# EasyEDA Pro project ProPrj_温室控制单_2026-01-03.epro

# Schematic Schematic1

## Sheets
1 主: Board Name: Board1; Create Date: 2025-12-29; Page Name: 主; Project Name: 温室控制单; Schematic Name: Schematic1; Update Date: 2025-12-29; Company: 嘉立创EDA; Page Size: A4; Version: V1.0
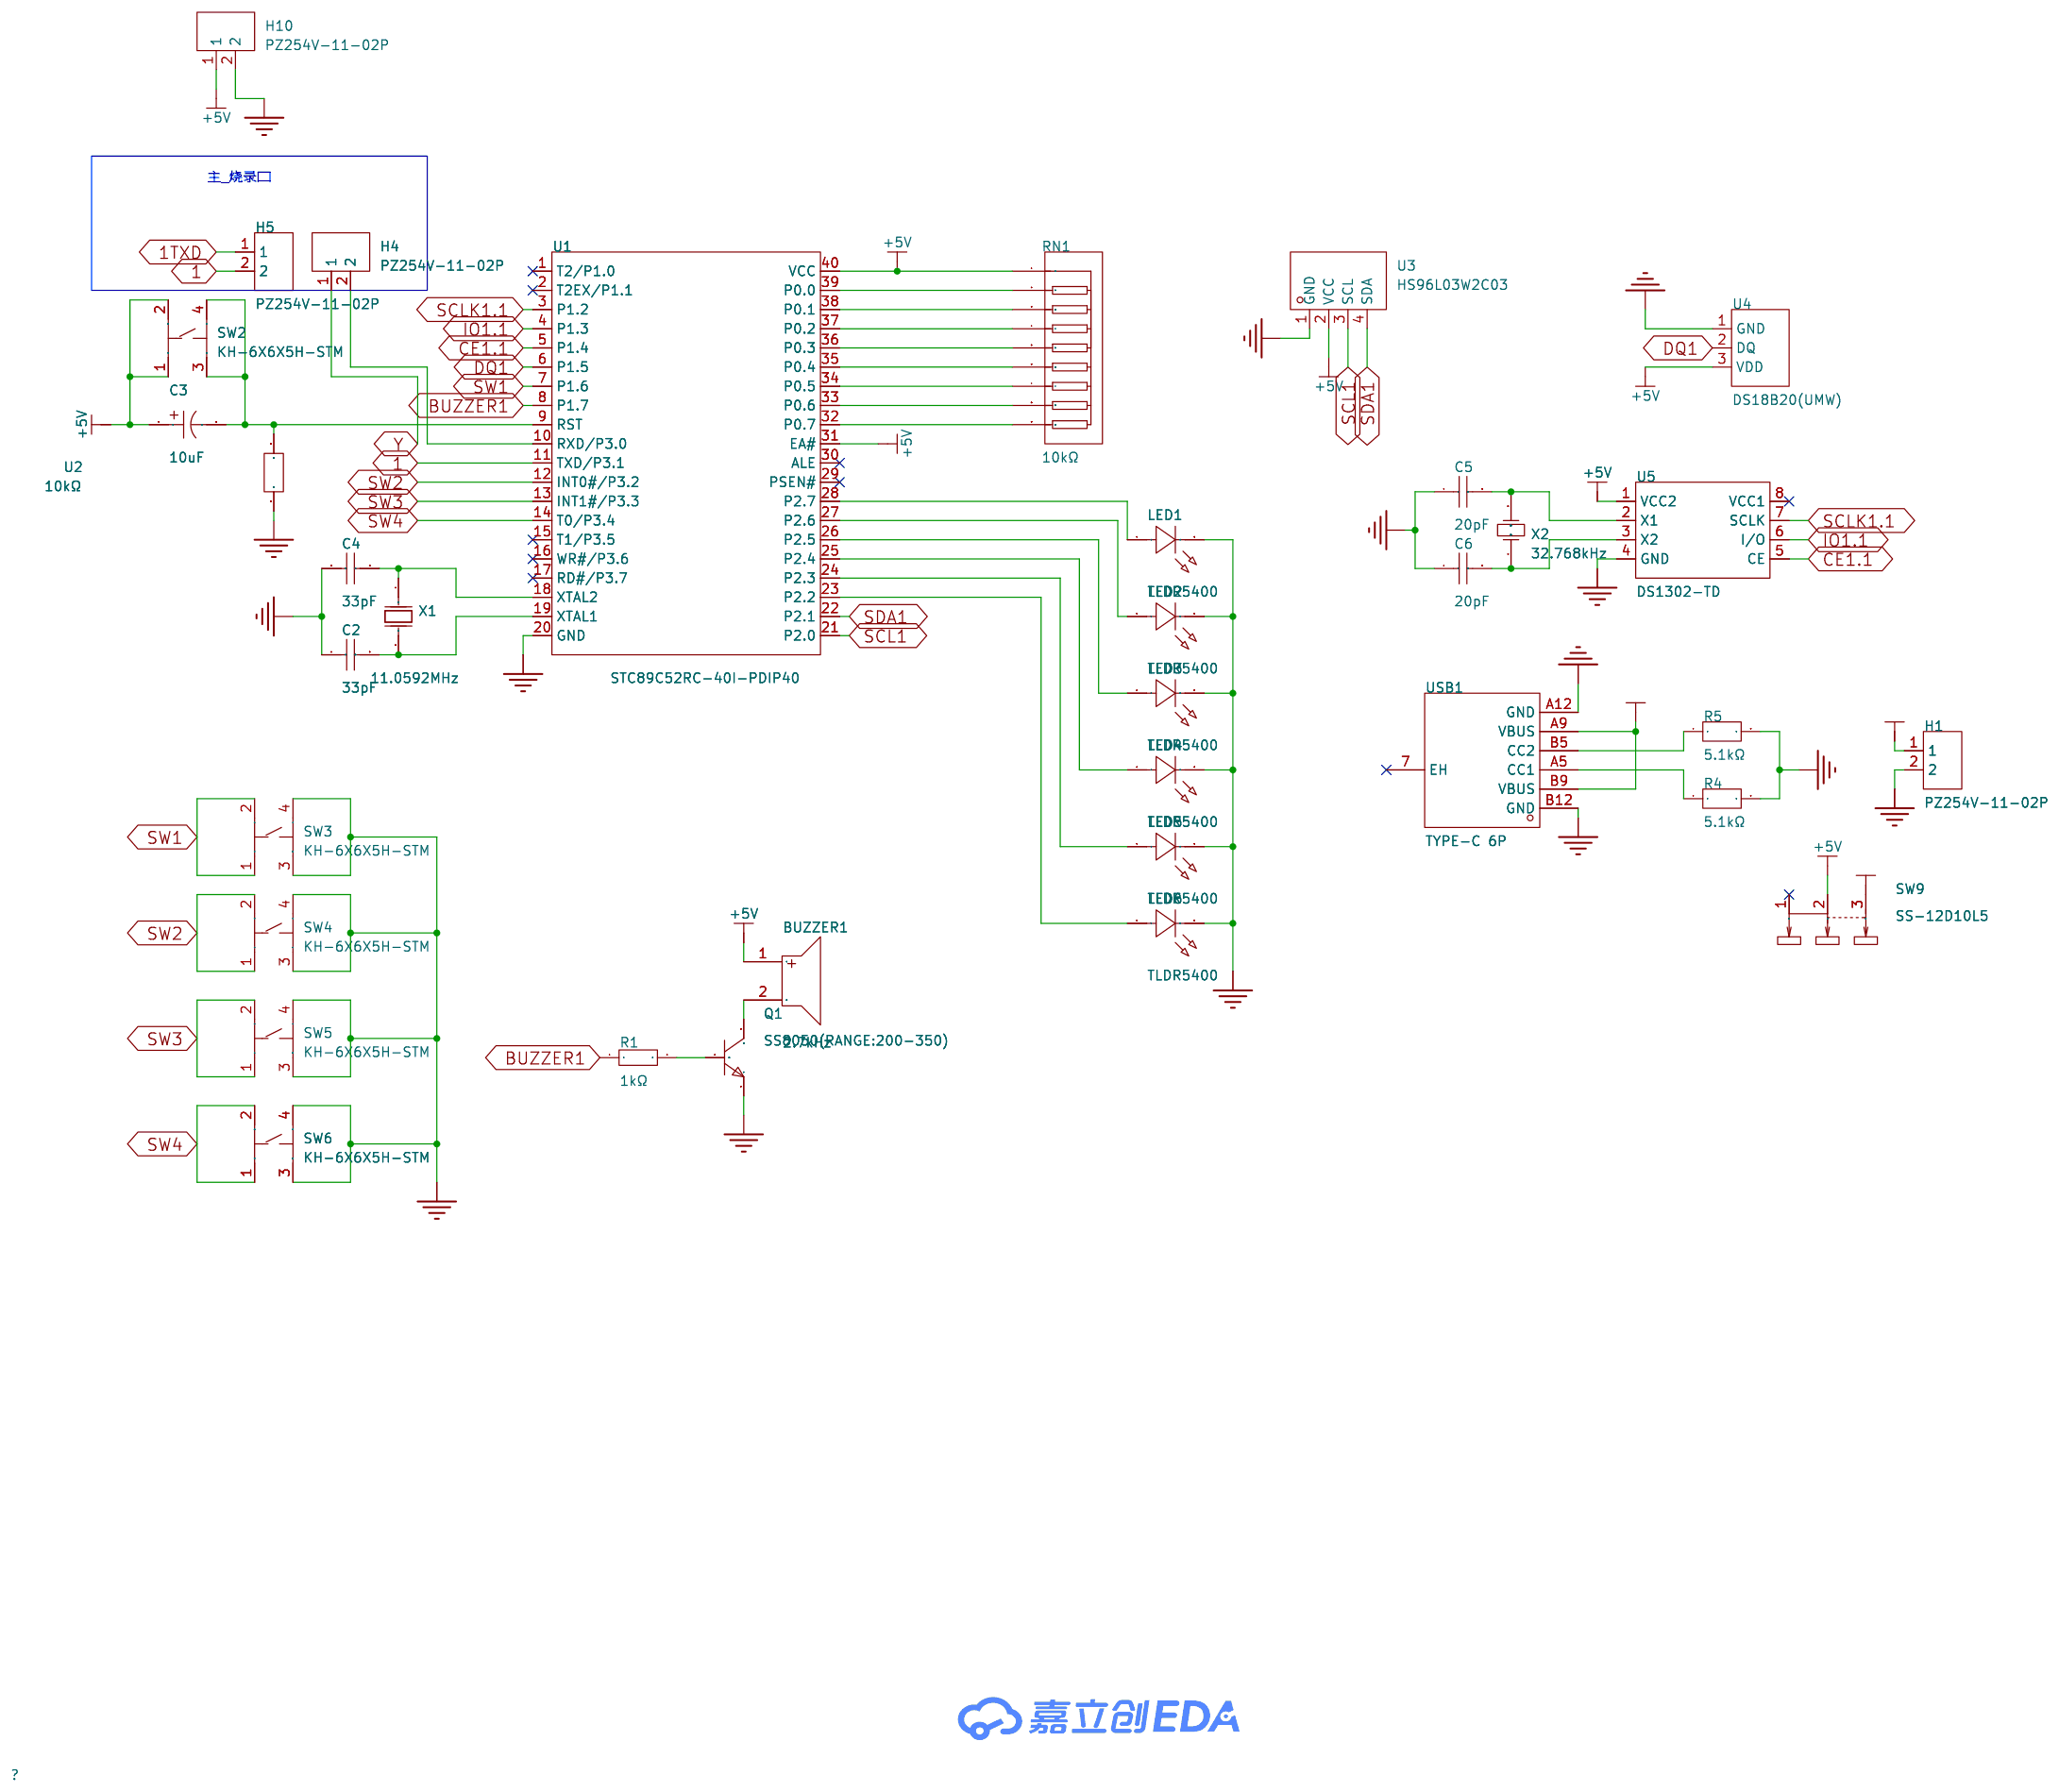
[diagram p0: 主]
2 从1: Page Name: 从1; Update Date: 2026-01-03
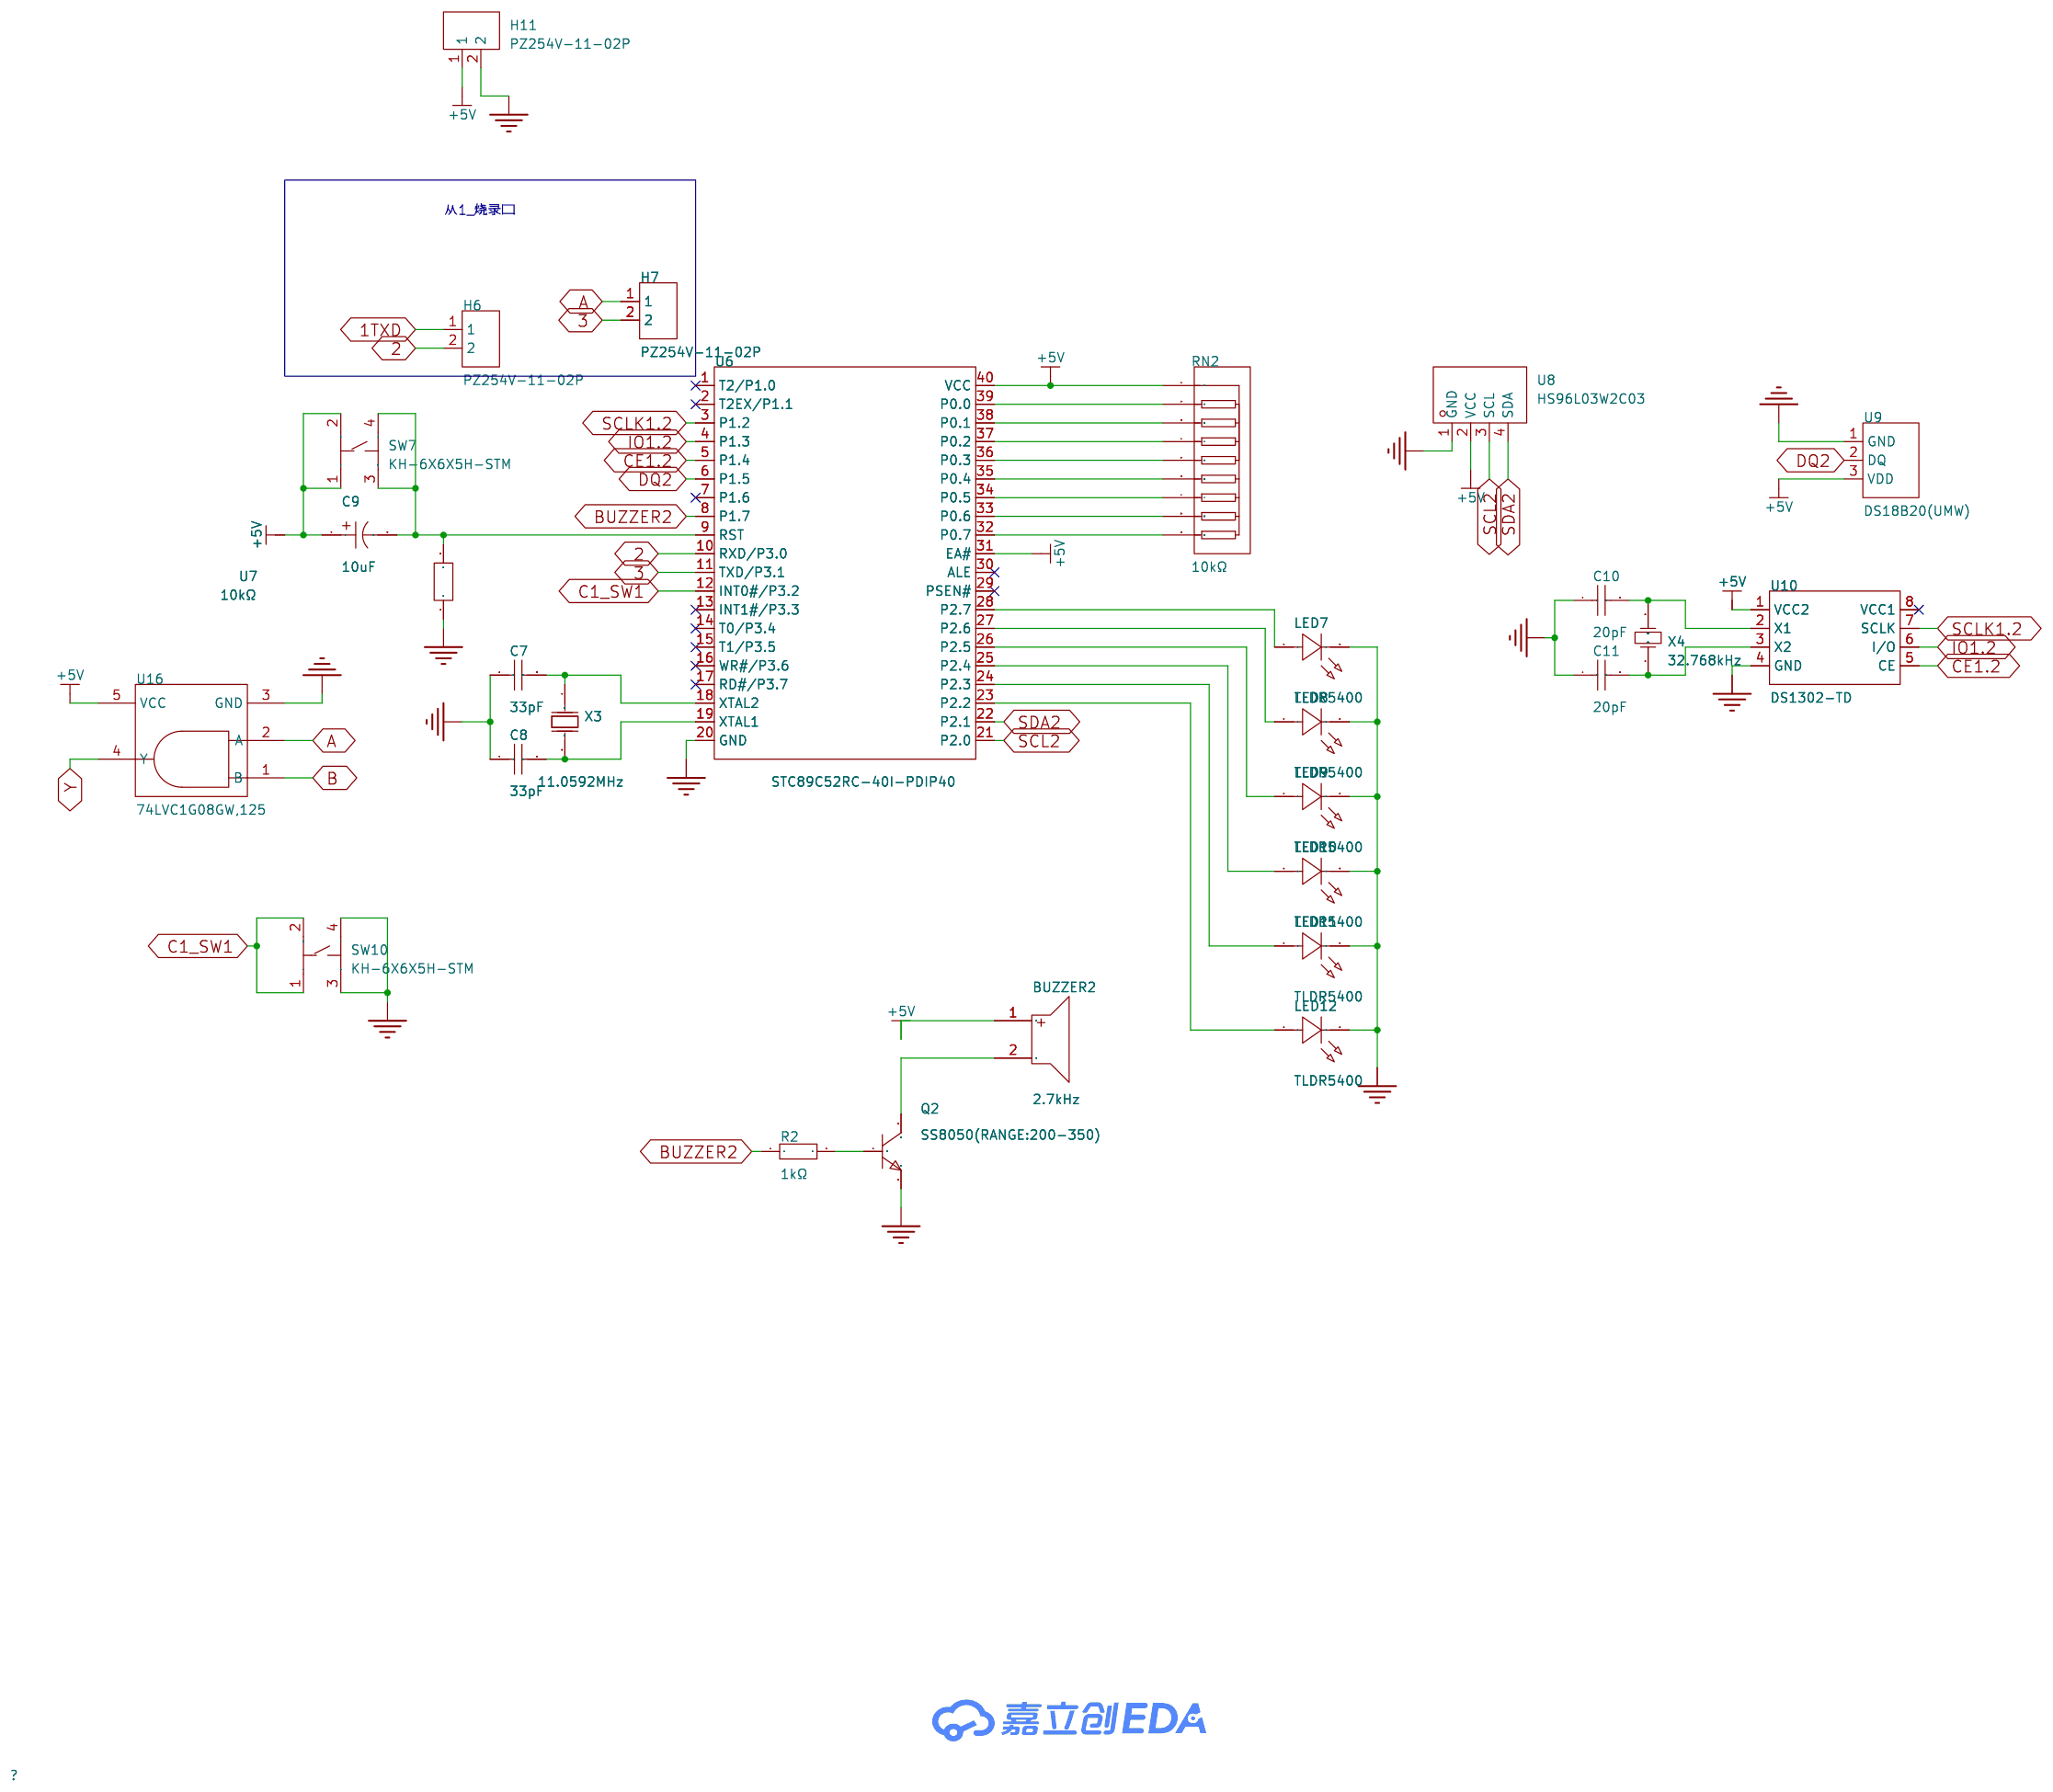
[diagram p1: 从1]
3 从2: Page Name: 从2
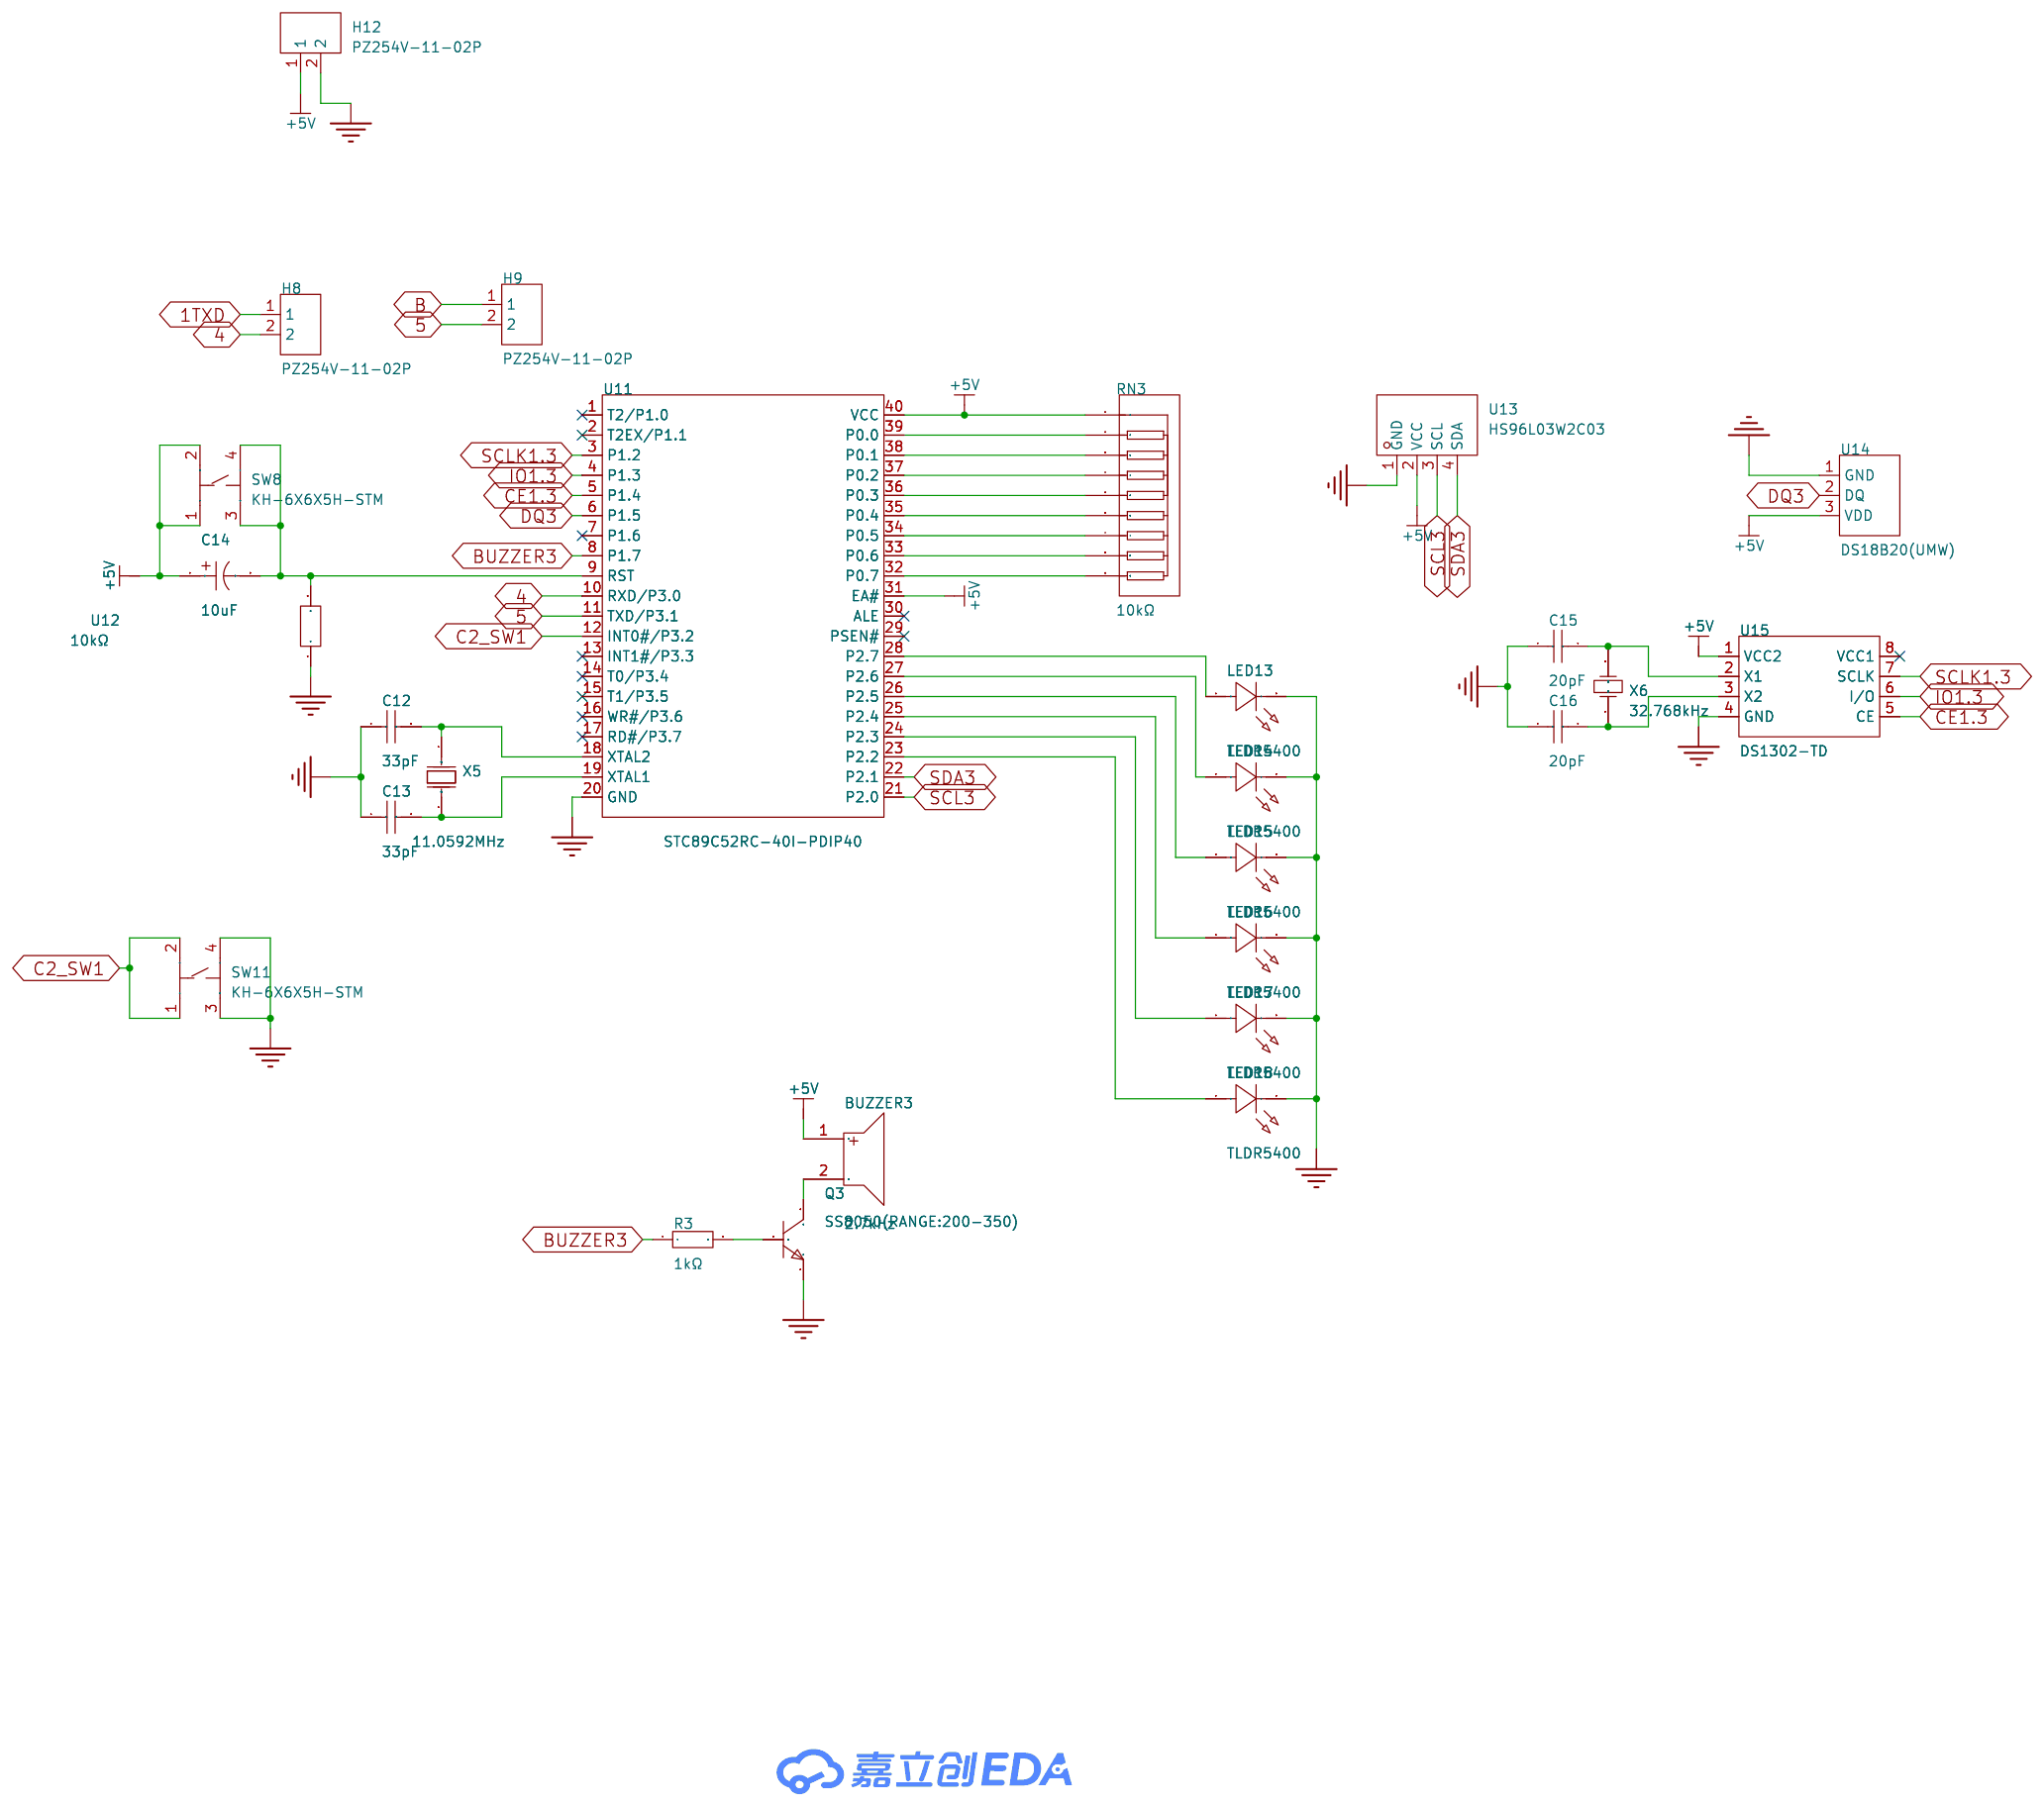
[diagram p2: 从2]

## Parts
sheet 主
BUZZER1  2.7kHz  [BUZ-TH_BD9.0-P4.00-D0.6-FD]
C2  33pF  [C0603]
C3  10uF  [CAP-TH_BD10.0-P5.00-D0.6-FD_1]
C4  33pF  [C0603]
C5  20pF  [C0603]
C6  20pF  [C0603]
H1  PZ254V-11-02P  [HDR-TH_2P-P2.54-V-M]
H4  PZ254V-11-02P  [HDR-TH_2P-P2.54-V-M]
H5  PZ254V-11-02P  [HDR-TH_2P-P2.54-V-M]
H10  PZ254V-11-02P  [HDR-TH_2P-P2.54-V-M]
LED1  TLDR5400  [LED-TH_BD5.8-P2.54-FD_RED]
LED2  TLDR5400  [LED-TH_BD5.8-P2.54-FD_RED]
LED3  TLDR5400  [LED-TH_BD5.8-P2.54-FD_RED]
LED4  TLDR5400  [LED-TH_BD5.8-P2.54-FD_RED]
LED5  TLDR5400  [LED-TH_BD5.8-P2.54-FD_RED]
LED6  TLDR5400  [LED-TH_BD5.8-P2.54-FD_RED]
Q1  SS8050(RANGE:200-350)  [SOT-23-3_L2.9-W1.3-P1.90-LS2.4-BR]
R1  1kΩ  [RES-TH_BD2.5-L6.5-P10.50-D0.6]
R4  5.1kΩ  [RES-TH_BD2.3-L6.5-P10.50-D0.5]
R5  5.1kΩ  [RES-TH_BD2.3-L6.5-P10.50-D0.5]
RN1  10kΩ  [RES-ARRAY-TH_9P-P2.54-D1.0]
SW2  KH-6X6X5H-STM  [SW-SMD_4P-L6.0-W6.0-P4.50-LS9.0_H5.0]
SW3  KH-6X6X5H-STM  [SW-SMD_4P-L6.0-W6.0-P4.50-LS9.0_H5.0]
SW4  KH-6X6X5H-STM  [SW-SMD_4P-L6.0-W6.0-P4.50-LS9.0_H5.0]
SW5  KH-6X6X5H-STM  [SW-SMD_4P-L6.0-W6.0-P4.50-LS9.0_H5.0]
SW6  KH-6X6X5H-STM  [SW-SMD_4P-L6.0-W6.0-P4.50-LS9.0_H5.0]
SW9  SS-12D10L5  [SW-TH_SS-12D10L5]
U1  STC89C52RC-40I-PDIP40  [DIP-40_L52.0-W13.7-P2.54-LS15.2-BL]
U2  10kΩ  [RES-TH_BD2.3-L6.3-P10.30-D0.6]
U3  HS96L03W2C03  [OLED-TH_L27.8-W27.2-P2.54_C9900033791]
U4  DS18B20(UMW)  [TO-92-3_L4.9-W3.7-P1.27-L]
U5  DS1302-TD  [SOP-8_L4.9-W3.9-P1.27-LS6.0-BL]
USB1  TYPE-C 6P  [TYPE-C-SMD_TYPE-C-6P]
X1  11.0592MHz  [HC-49US_L11.5-W4.5-P4.88]
X2  32.768kHz  [OSC-TH_BD3.1-P0.8-D0.3]
sheet 从1
BUZZER2  2.7kHz  [BUZ-TH_BD9.0-P4.00-D0.6-FD]
C7  33pF  [C0603]
C8  33pF  [C0603]
C9  10uF  [CAP-TH_BD10.0-P5.00-D0.6-FD_1]
C10  20pF  [C0603]
C11  20pF  [C0603]
H6  PZ254V-11-02P  [HDR-TH_2P-P2.54-V-M]
H7  PZ254V-11-02P  [HDR-TH_2P-P2.54-V-M]
H11  PZ254V-11-02P  [HDR-TH_2P-P2.54-V-M]
LED7  TLDR5400  [LED-TH_BD5.8-P2.54-FD_RED]
LED8  TLDR5400  [LED-TH_BD5.8-P2.54-FD_RED]
LED9  TLDR5400  [LED-TH_BD5.8-P2.54-FD_RED]
LED10  TLDR5400  [LED-TH_BD5.8-P2.54-FD_RED]
LED11  TLDR5400  [LED-TH_BD5.8-P2.54-FD_RED]
LED12  TLDR5400  [LED-TH_BD5.8-P2.54-FD_RED]
Q2  SS8050(RANGE:200-350)  [SOT-23-3_L2.9-W1.3-P1.90-LS2.4-BR]
R2  1kΩ  [RES-TH_BD2.5-L6.5-P10.50-D0.6]
RN2  10kΩ  [RES-ARRAY-TH_9P-P2.54-D1.0]
SW7  KH-6X6X5H-STM  [SW-SMD_4P-L6.0-W6.0-P4.50-LS9.0_H5.0]
SW10  KH-6X6X5H-STM  [SW-SMD_4P-L6.0-W6.0-P4.50-LS9.0_H5.0]
U6  STC89C52RC-40I-PDIP40  [DIP-40_L52.0-W13.7-P2.54-LS15.2-BL]
U7  10kΩ  [RES-TH_BD2.3-L6.3-P10.30-D0.6]
U8  HS96L03W2C03  [OLED-TH_L27.8-W27.2-P2.54_C9900033791]
U9  DS18B20(UMW)  [TO-92-3_L4.9-W3.7-P1.27-L]
U10  DS1302-TD  [SOP-8_L4.9-W3.9-P1.27-LS6.0-BL]
U16  74LVC1G08GW,125  [SOT-353_L2.1-W1.3-P0.65-LS2.3-BR]
X3  11.0592MHz  [HC-49US_L11.5-W4.5-P4.88]
X4  32.768kHz  [OSC-TH_BD3.1-P0.8-D0.3]
sheet 从2
BUZZER3  2.7kHz  [BUZ-TH_BD9.0-P4.00-D0.6-FD]
C12  33pF  [C0603]
C13  33pF  [C0603]
C14  10uF  [CAP-TH_BD10.0-P5.00-D0.6-FD_1]
C15  20pF  [C0603]
C16  20pF  [C0603]
H8  PZ254V-11-02P  [HDR-TH_2P-P2.54-V-M]
H9  PZ254V-11-02P  [HDR-TH_2P-P2.54-V-M]
H12  PZ254V-11-02P  [HDR-TH_2P-P2.54-V-M]
LED13  TLDR5400  [LED-TH_BD5.8-P2.54-FD_RED]
LED14  TLDR5400  [LED-TH_BD5.8-P2.54-FD_RED]
LED15  TLDR5400  [LED-TH_BD5.8-P2.54-FD_RED]
LED16  TLDR5400  [LED-TH_BD5.8-P2.54-FD_RED]
LED17  TLDR5400  [LED-TH_BD5.8-P2.54-FD_RED]
LED18  TLDR5400  [LED-TH_BD5.8-P2.54-FD_RED]
Q3  SS8050(RANGE:200-350)  [SOT-23-3_L2.9-W1.3-P1.90-LS2.4-BR]
R3  1kΩ  [RES-TH_BD2.5-L6.5-P10.50-D0.6]
RN3  10kΩ  [RES-ARRAY-TH_9P-P2.54-D1.0]
SW8  KH-6X6X5H-STM  [SW-SMD_4P-L6.0-W6.0-P4.50-LS9.0_H5.0]
SW11  KH-6X6X5H-STM  [SW-SMD_4P-L6.0-W6.0-P4.50-LS9.0_H5.0]
U11  STC89C52RC-40I-PDIP40  [DIP-40_L52.0-W13.7-P2.54-LS15.2-BL]
U12  10kΩ  [RES-TH_BD2.3-L6.3-P10.30-D0.6]
U13  HS96L03W2C03  [OLED-TH_L27.8-W27.2-P2.54_C9900033791]
U14  DS18B20(UMW)  [TO-92-3_L4.9-W3.7-P1.27-L]
U15  DS1302-TD  [SOP-8_L4.9-W3.9-P1.27-LS6.0-BL]
X5  11.0592MHz  [HC-49US_L11.5-W4.5-P4.88]
X6  32.768kHz  [OSC-TH_BD3.1-P0.8-D0.3]

## Library data of the parts
BUZZER1-BUZZER3 = QMB-09B-03: 驱动方式:无源(外部驱动);构造类型:电磁式;频率:2.7kHz;声压(SPL):85dB;; LCSC Part Name: 无源蜂鸣器QMB-09B-03; Supplier Part: C96256; Manufacturer: 华能; Supplier Footprint: 插件,D=9mm; JLCPCB Part Class: 扩展库; Datasheet: https://item.szlcsc.com/datasheet/QMB-09B-03/97460.html; Supplier: LCSC; Driver Circuitry: 无源(外部驱动); Technology: 电磁式; Voltage - Supply: 2V~5V; Sound Pressure Level(SPL): 85dB; Diameter(φD): 9mm; Height: 5.7mm
C2 C4 C7 C8 C12 C13 = CL10C330JB8NNNC: 容值:33pF;精度:±5%;额定电压:50V;温度系数:C0G;; LCSC Part Name: 33pF ±5% 50V; Supplier Part: C1663; Manufacturer: SAMSUNG(三星); Supplier Footprint: 0603; JLCPCB Part Class: 基础库; Datasheet: https://item.szlcsc.com/datasheet/CL10C330JB8NNNC/2015.html; Supplier: LCSC; Tolerance: ±5%; Voltage Rating: 50V; Temperature Coefficient: C0G
C3 C9 C14 = ERG450V10M10x16: 容值:10uF;精度:±20%;额定电压:450V;纹波电流:100mA@100kHz;等效串联电阻(ESR):9.45Ω@100kHz;; LCSC Part Name: 10uF ±20% 450V; Supplier Part: C46552835; Manufacturer: JIERR(捷而瑞); Supplier Footprint: 插件,D10xL16mm; JLCPCB Part Class: 扩展库; Datasheet: https://item.szlcsc.com/datasheet/ERG450V10M10x16/48687203.html; Supplier: LCSC; Tolerance: ±20%; Voltage Rating: 450V; Ripple Current: 100mA@100kHz; Equivalent Series Resistance(ESR): 9.45Ω@100kHz; Pin Spacing: 5mm; Diameter: 10mm; Height - Seated (Max): 16mm; Lifetime: 2000hrs@105℃; Operating Temperature: -25℃~+105℃
C5 C6 C10 C11 C15 C16 = CL10C200JB8NNNC: 容值:20pF;精度:±5%;额定电压:50V;温度系数:C0G;; LCSC Part Name: 20pF ±5% 50V; Supplier Part: C1648; Manufacturer: SAMSUNG(三星); Supplier Footprint: 0603; JLCPCB Part Class: 基础库; Datasheet: https://item.szlcsc.com/datasheet/CL10C200JB8NNNC/2000.html; Supplier: LCSC; Tolerance: ±5%; Voltage Rating: 50V; Temperature Coefficient: C0G
H1 H4-H12 = PZ254V-11-02P: 插针结构:1x2P;间距:2.54mm;行距:-;圆针/方针:方针;安装方式:直插;排数:单排;总PIN位数:2P;额定电流:-;额定电压:-;配合针长度:6mm;塑高:2.5mm;端接针长度:3mm;触头材质:黄铜;触头镀层:-;工作温度:-40℃~+105℃;颜色:黑色;; LCSC Part Name: 1x2P 间距:2.54mm 方针 直插; Supplier Part: C492401; Manufacturer: XFCN(兴飞); Supplier Footprint: 插件,P=2.54mm; JLCPCB Part Class: 扩展库; Datasheet: https://item.szlcsc.com/datasheet/PZ254V-11-02P/502957.html; Supplier: LCSC; Pin Structure: 1x2P; Pitch: 2.54mm; Circluar Pins/Square Pins: 方针; Mounting Type: 直插; Number of Rows: 单排; Number of Pins: 2P; Length of Mating Pin: 6mm; Insulation Height: 2.5mm; Length of End Connection Pin: 3mm; Contact Material: 黄铜; Operating Temperature: -40℃~+105℃; Color: 黑色
LED1-LED18 = TLDR5400: 发光颜色:红色;正向压降(Vf):1.8V~2.2V;功率:100mW;正向电流:20mA;波长:648nm;透镜颜色:雾状红色透镜;发光强度:70mcd;发光角度:60°;工作温度:-40℃~+100℃;; LCSC Part Name: 高亮度LED，5mm有色漫射封装; Supplier Part: C6332993; Manufacturer: VISHAY(威世); Supplier Footprint: 插件; JLCPCB Part Class: 扩展库; Datasheet: https://item.szlcsc.com/datasheet/TLDR5400/7281246.html; Supplier: LCSC; Illumination Color: 红色; Voltage - Forward(Vf): 1.8V~2.2V; Power(Watts): 100mW; Forward Current: 20mA; Wavelength - Dominant: 648nm; Peak Wavelength: 650nm; Lens Color: 雾状红色透镜; Luminous Intensity: 70mcd; Viewing Angle: 60°; Operating Temperature: -40℃~+100℃
Q1-Q3 = SS8050(RANGE:200-350)_C2150: 晶体管类型:NPN;集电极电流(Ic):1.5A;集射极击穿电压(Vceo):25V;耗散功率(Pd):300mW;直流电流增益(hFE):200@800mA,1V;; LCSC Part Name: hfe=200~350 NPN 电流:1.5A 电压:25V; Supplier Part: C2150; Manufacturer: CJ(江苏长电/长晶); Supplier Footprint: SOT-23; JLCPCB Part Class: 基础库; Datasheet: https://item.szlcsc.com/datasheet/SS8050(RANGE%253A200-350)/2507.html; Supplier: LCSC; type: NPN; Current - Collector(Ic): 1.5A; Collector - Emitter Voltage VCEO: 25V; Pd - Power Dissipation: 300mW; DC Current Gain: 200@800mA,1V; Transition frequency(fT): 100MHz; Current - Collector Cutoff: 100nA; Vce Saturation(VCE(sat)): 500mV@800mA,80mA; Operating Temperature: -55℃~+150℃; Emitter-Base Voltage(Vebo): 5V; Number: 1个NPN
R1-R3 = MFR0W4F1001A50: 电阻类型:金属膜电阻;阻值:1kΩ;精度:±1%;功率:250mW;温度系数:±50ppm/℃;; LCSC Part Name: 1kΩ ±1% 250mW 金属膜电阻 铜脚，圆柱状直插; Supplier Part: C57435; Manufacturer: UNI-ROYAL(厚声); Supplier Footprint: 插件,D2.2xL6.5mm; JLCPCB Part Class: 扩展库; Datasheet: https://atta.szlcsc.com/upload/public/pdf/source/20191012/C436293_8820AA14BC71FA35E551C06C441482A0.pdf; Supplier: LCSC; Type: 金属膜电阻; Tolerance: ±1%; Voltage-Supply(Max): 250V; Power(Watts): 250mW; Temperature Coefficient: ±50ppm/℃
R4 R5 = MF1/4W-5.1KΩ±1%T52: 电阻类型:金属膜电阻;阻值:5.1kΩ;精度:±1%;功率:250mW;温度系数:±200ppm/℃;; LCSC Part Name: 金属膜电阻 5.1kΩ ±1% 250mW; Supplier Part: C714010; Manufacturer: 华星机电; Supplier Footprint: 插件,D2.3xL6.5mm; JLCPCB Part Class: 扩展库; Datasheet: https://atta.szlcsc.com/upload/public/pdf/source/20200731/C713882_AE8EB1102749D7E4FB4FB13DC898C429.pdf; Supplier: LCSC; Type: 金属膜电阻; Tolerance: ±1%; Power(Watts): 250mW; Temperature Coefficient: ±200ppm/℃
RN1-RN3 = A09-103JP: 电阻器数:8;阻值:10kΩ;精度:±5%;单个元件功率:125mW;温度系数:±100ppm/℃;; LCSC Part Name: 10kΩ ±5%; Supplier Part: C8692; Manufacturer: FH(风华); Supplier Footprint: SIP-9-2.54mm; JLCPCB Part Class: 扩展库; Datasheet: https://atta.szlcsc.com/upload/public/pdf/source/20181127/C336620_2E84FA9E7B5BF76546BC661699514FB8.pdf; Supplier: LCSC; Number of Resistors: 8; Tolerance: ±5%; Power(Watts): 125mW; Temperature Coefficient: ±100ppm/℃; Number of Pins: 9
SW2-SW8 SW10 SW11 = KH-6X6X5H-STM: 电路结构:单刀单掷;按钮形状:圆形按钮;安装方式:立贴;开关长度:6mm;开关宽度:6mm;开关高度:5mm;带支架:不带支架;触点电流:50mA;额定电压:12V;工作寿命:8万次;; LCSC Part Name: 6*6*5mm 立贴 轻触开关; Supplier Part: C2837531; Manufacturer: kinghelm(金航标); Supplier Footprint: SMD-4P,6x6mm; JLCPCB Part Class: 扩展库; Datasheet: https://item.szlcsc.com/datasheet/KH-6X6X5H-STM/3009601.html; Supplier: LCSC; Circuit: 单刀单掷; Actuator Style: 圆形按钮; Mounting Type: 立贴; Length: 6mm; Width: 6mm; Switch Height: 5mm; with Bracket: 不带支架; Contact Current: 50mA; Voltage Rating: 12V; Actuator/Cap Color: 黑色; Termination Style: 鸥翼型; Life: 8万次
SW9 = SS-12D10L5: 电路结构:单刀双掷;安装方式:直插;开关颜色:黑色;额定电流:3A;额定电压:125V;工作寿命:1万次;; LCSC Part Name: 柄长5mm 直插双档 滑动开关; Supplier Part: C319012; Manufacturer: XKB Connection(中国星坤); Supplier Footprint: 插件,13x6.8mm; JLCPCB Part Class: 扩展库; Datasheet: https://item.szlcsc.com/datasheet/SS-12D10L5/300104.html; Supplier: LCSC; Circuit: 单刀双掷; Actuator Style: 矩形柱状; Termination Style: PC引脚; Length: 13mm; Width: 6.8mm; Switch Height: 6.4mm; Mounting Type: 直插; Actuator Color: 黑色; Current Rating: 3A; Voltage Rating: 125V; Life: 1万次; Operating Temperature: -40℃~+85℃
U1 U6 U11 = STC89C52RC-40I-PDIP40: CPU内核:51家族;CPU最大主频:-;; Supplier Part: C14022; Manufacturer: STC; Supplier Footprint: DIP-40; JLCPCB Part Class: 扩展库; Datasheet: https://item.szlcsc.com/datasheet/STC89C52RC-40I-PDIP40/14679.html; Supplier: LCSC; CPU Core: 51家族; Program Storage Size: 8KB; Program Memory Type: FLASH; Voltage - Supply: 3.3V~5.5V
U2 U7 U12 = LR1F10K: 电阻类型:金属膜电阻;阻值:10kΩ;精度:±1%;功率:600mW;温度系数:±50ppm/℃;; LCSC Part Name: 金属膜电阻 10kΩ ±1% 600mW; Supplier Part: C1367502; Manufacturer: TE Connectivity(泰科电子); Supplier Footprint: 插件; JLCPCB Part Class: 扩展库; Datasheet: https://item.szlcsc.com/datasheet/LR1F10K/1457791.html; Supplier: LCSC; Type: 金属膜电阻; Tolerance: ±1%; Power(Watts): 600mW; Temperature Coefficient: ±50ppm/℃; Operating Temperature: -55℃~+155℃
U3 U8 U13 = HS96L03W2C03: 主控芯片:SSD1315;接口类型:I2C;尺寸(inch):0.96;像素分辨率:128x64;; LCSC Part Name: 0.96寸OLED显示屏窄白光IIC; Supplier Part: C5248080; Manufacturer: HS(汉昇); JLCPCB Part Class: 扩展库; Datasheet: https://atta.szlcsc.com/upload/public/pdf/source/20230627/763D01F79A90007632F098068C7C8AD9.pdf; Supplier: LCSC; Main Control Chip: SSD1315; Interface Type: I2C; Size: 0.96; Pixel Resolution: 128x64; Operating Temperature: -40℃~+70℃
U4 U9 U14 = DS18B20(UMW): 温度范围:-55℃~+125℃;精度:±0.4℃;接口类型:-;; LCSC Part Name: DS18B20; Supplier Part: C376006; Manufacturer: UMW(友台半导体); Supplier Footprint: TO-92; JLCPCB Part Class: 扩展库; Datasheet: https://item.szlcsc.com/datasheet/DS18B20(UMW)/348632.html; Supplier: LCSC; Temperature Range: -55℃~+125℃; Tolerance: ±0.4℃; Voltage - Supply: 3V~5.5V
U5 U10 U15 = DS1302-TD: 接口类型:SPI;晶振:外置;闹钟输出:有;; LCSC Part Name: 涓流充电计时电路; Supplier Part: C42421867; Manufacturer: TDSEMIC(拓电半导体); Supplier Footprint: SOP-8; JLCPCB Part Class: 扩展库; Datasheet: https://item.szlcsc.com/datasheet/DS1302-TD/44440119.html; Supplier: LCSC; Interface: SPI; Voltage - Supply: 2V~5.5V; Current - Supply: 300nA; crystal oscillator: 外置; Alarm Output: 有; Operating Temperature: -40℃~+85℃; Quiescent Current(Iq): 100nA
USB1 = TYPE-C 6P: 连接器类型:Type-C;标准:USB 3.1;公母:母;安装方式:卧贴;触点数量:6P;端口数量:1;额定电流 - 电源:5A;工作温度范围:-40℃~+85℃;; LCSC Part Name: Type-C 母 卧贴; Supplier Part: C456012; Manufacturer: SHOU HAN(首韩); Supplier Footprint: SMD; JLCPCB Part Class: 扩展库; Datasheet: https://atta.szlcsc.com/upload/public/pdf/source/20201203/C456012_B13F72044DF846EDBE9BDD0D1D3CD166.pdf; Supplier: LCSC; Connector Type: Type-C; Standard: USB 3.1; Gender: 母; Mounting Style: 卧贴; Number of Contacts: 6P; Number of Ports: 1; Current Rating - Power (Max): 5A; Operating Temperature Range: -40℃~+85℃; Rated Voltage (Max): 20V; Connect-Disconnect Life: 3千次; Core Colour: 黑色
X1 X3 X5 = X49SD110592MSD2SC: 晶振类型:直插晶振;频率:11.0592MHz;常温频差:±20ppm;负载电容:20pF;频率稳定度:±30ppm;; LCSC Part Name: HC-49US 11.0592MHZ 2P 49S 20PF ±20PPM -20~70℃（±30PPM）; Supplier Part: C2203; Manufacturer: YXC(扬兴晶振); Supplier Footprint: HC-49S; JLCPCB Part Class: 扩展库; Datasheet: https://item.szlcsc.com/datasheet/X49SD110592MSD2SC/2572.html; Supplier: LCSC; Type: 直插晶振; Normal temperature Frequency Tolerance: ±20ppm; Load Capacitance: 20pF; Frequency Stability: ±30ppm; Operating Temperature: -20℃~+70℃
X2 X4 X6 = X308032768KGB2SC: 晶振类型:直插晶振;频率:32.768kHz;常温频差:±10ppm;负载电容:12.5pF;频率稳定度:±20ppm;; LCSC Part Name: YT-38 32.768KHZ 2P 3080 12.5PF ±10PPM -20~70℃; Supplier Part: C52082; Manufacturer: YXC(扬兴晶振); Supplier Footprint: DT-38; JLCPCB Part Class: 扩展库; Datasheet: https://item.szlcsc.com/datasheet/X308032768KGB2SC/53096.html; Supplier: LCSC; Type: 直插晶振; Normal temperature Frequency Tolerance: ±10ppm; Load Capacitance: 12.5pF; Frequency Stability: ±20ppm; Operating Temperature: -20℃~+70℃
U16 = 74LVC1G08GW,125: 逻辑类型:与门;通道数:1;电源电压:1.65V~5.5V;静态电流(最大值):4uA;最大传播延迟:4ns@5V,50pF;; Supplier Part: C12512; Manufacturer: Nexperia(安世); Supplier Footprint: SOT-353; JLCPCB Part Class: 扩展库; Datasheet: https://atta.szlcsc.com/upload/public/pdf/source/20240724/60B4D768819A87611FAE1882E587B58A.pdf; Supplier: LCSC; Logic Gate Type: 与门; Number of Channels: 1; Supply Voltage: 1.65V~5.5V; Quiescent Current (Max): 4uA; Sink Current: 32mA; Source Current: 32mA; High Level Range (VIH): 1.7V~2V; Low Level Range (VIL): 700mV~800mV; Series: 74LVC系列; Propagation Delay Time: 4ns@5V,50pF; Operating Temperature: -40℃~+125℃

## Nets
+5V: BUZZER1.1 BUZZER2.1 BUZZER3.1 C3.1 C9.1 C14.1 H10.1 H11.1 H12.1 RN1.1 RN2.1 RN3.1 SW2.1 SW2.2 SW7.1 SW7.2 SW8.1 SW8.2 SW9.2 U1.31(EA#) U1.40(VCC) U3.2(VCC) U4.3(VDD) U5.1(VCC2) U6.31(EA#) U6.40(VCC) U8.2(VCC) U9.3(VDD) U10.1(VCC2) U11.31(EA#) U11.40(VCC) U13.2(VCC) U14.3(VDD) U15.1(VCC2) U16.5(VCC)
GND: C2.1 C4.1 C5.1 C6.1 C7.1 C8.1 C10.1 C11.1 C12.1 C13.1 C15.1 C16.1 H1.2 H10.2 H11.2 H12.2 LED1.2(K) LED2.2(K) LED3.2(K) LED4.2(K) LED5.2(K) LED6.2(K) LED7.2(K) LED8.2(K) LED9.2(K) LED10.2(K) LED11.2(K) LED12.2(K) LED13.2(K) LED14.2(K) LED15.2(K) LED16.2(K) LED17.2(K) LED18.2(K) Q1.2(E) Q2.2(E) Q3.2(E) R4.2 R5.2 SW3.3 SW3.4 SW4.3 SW4.4 SW5.3 SW5.4 SW6.3 SW6.4 SW10.3 SW10.4 SW11.3 SW11.4 U1.20(GND) U2.1 U3.1(GND) U4.1(GND) U5.4(GND) U6.20(GND) U7.1 U8.1(GND) U9.1(GND) U10.4(GND) U11.20(GND) U12.1 U13.1(GND) U14.1(GND) U15.4(GND) U16.3(GND) USB1.A12(GND) USB1.B12(GND)
V0: H1.1 SW9.3 USB1.A9(VBUS) USB1.B9(VBUS)
1: H5.2 U1.11(TXD/P3.1)
1TXD: H5.1 H6.1 H8.1
2: H6.2 U6.10(RXD/P3.0)
3: H7.2 U6.11(TXD/P3.1)
4: H8.2 U11.10(RXD/P3.0)
5: H9.2 U11.11(TXD/P3.1)
A: H7.1 U16.2(A)
B: H9.1 U16.1(B)
BUZZER1: R1.1 U1.8(P1.7)
BUZZER2: R2.1 U6.8(P1.7)
BUZZER3: R3.1 U11.8(P1.7)
C1_SW1: SW10.1 SW10.2 U6.12(INT0#/P3.2)
C2_SW1: SW11.1 SW11.2 U11.12(INT0#/P3.2)
CE1.1: U1.5(P1.4) U5.5(CE)
CE1.2: U6.5(P1.4) U10.5(CE)
CE1.3: U11.5(P1.4) U15.5(CE)
DQ1: U1.6(P1.5) U4.2(DQ)
DQ2: U6.6(P1.5) U9.2(DQ)
DQ3: U11.6(P1.5) U14.2(DQ)
IO1.1: U1.4(P1.3) U5.6(I/O)
IO1.2: U6.4(P1.3) U10.6(I/O)
IO1.3: U11.4(P1.3) U15.6(I/O)
SCL1: U1.21(P2.0) U3.3(SCL)
SCL2: U6.21(P2.0) U8.3(SCL)
SCL3: U11.21(P2.0) U13.3(SCL)
SCLK1.1: U1.3(P1.2) U5.7(SCLK)
SCLK1.2: U6.3(P1.2) U10.7(SCLK)
SCLK1.3: U11.3(P1.2) U15.7(SCLK)
SDA1: U1.22(P2.1) U3.4(SDA)
SDA2: U6.22(P2.1) U8.4(SDA)
SDA3: U11.22(P2.1) U13.4(SDA)
SW1: SW3.1 SW3.2 U1.7(P1.6)
SW2: SW4.1 SW4.2 U1.12(INT0#/P3.2)
SW3: SW5.1 SW5.2 U1.13(INT1#/P3.3)
SW4: SW6.1 SW6.2 U1.14(T0/P3.4)
Y: H4.1 U16.4(Y)
$1N2205: RN1.6 U1.35(P0.4)
$1N2206: RN1.7 U1.34(P0.5)
$1N2207: RN1.8 U1.33(P0.6)
$1N2208: RN1.9 U1.32(P0.7)
$1N2210: RN1.2 U1.39(P0.0)
$1N2211: RN1.3 U1.38(P0.1)
$1N2212: RN1.4 U1.37(P0.2)
$1N2213: RN1.5 U1.36(P0.3)
$1N2215: C4.2 U1.18(XTAL2) X1.1(OSC1)
$1N2216: C2.2 U1.19(XTAL1) X1.2(OSC2)
$1N2230: C3.2 SW2.3 SW2.4 U1.9(RST) U2.2
$1N2902: LED1.1(A) U1.28(P2.7)
$1N2907: LED2.1(A) U1.27(P2.6)
$1N2917: LED3.1(A) U1.26(P2.5)
$1N2940: LED4.1(A) U1.25(P2.4)
$1N2958: LED5.1(A) U1.24(P2.3)
$1N2967: LED6.1(A) U1.23(P2.2)
$1N3387: Q1.1(B) R1.2
$1N3460: BUZZER1.2 Q1.3(C)
$1N4123: C5.2 U5.2(X1) X2.2(OSC2)
$1N4127: C6.2 U5.3(X2) X2.1(OSC1)
$1N6009: R5.1 USB1.B5(CC2)
$1N6015: R4.1 USB1.A5(CC1)
$1N7833: H4.2 U1.10(RXD/P3.0)
$2N1741: LED7.1(A) U6.28(P2.7)
$2N1744: LED9.1(A) U6.26(P2.5)
$2N1748: LED10.1(A) U6.25(P2.4)
$2N1752: LED8.1(A) U6.27(P2.6)
$2N1764: C9.2 SW7.3 SW7.4 U6.9(RST) U7.2
$2N1827: C8.2 U6.19(XTAL1) X3.2(OSC2)
$2N1829: C7.2 U6.18(XTAL2) X3.1(OSC1)
$2N1841: LED11.1(A) U6.24(P2.3)
$2N1845: LED12.1(A) U6.23(P2.2)
$2N1853: RN2.7 U6.34(P0.5)
$2N1854: RN2.8 U6.33(P0.6)
$2N1855: RN2.9 U6.32(P0.7)
$2N1856: RN2.3 U6.38(P0.1)
$2N1857: RN2.4 U6.37(P0.2)
$2N1858: RN2.6 U6.35(P0.4)
$2N1859: RN2.5 U6.36(P0.3)
$2N1860: RN2.2 U6.39(P0.0)
$2N1864: BUZZER2.2 Q2.3(C)
$2N1872: C11.2 U10.3(X2) X4.1(OSC1)
$2N1879: C10.2 U10.2(X1) X4.2(OSC2)
$2N1897: Q2.1(B) R2.2
$3N1449: C12.2 U11.18(XTAL2) X5.1(OSC1)
$3N1454: C14.2 SW8.3 SW8.4 U11.9(RST) U12.2
$3N1464: C13.2 U11.19(XTAL1) X5.2(OSC2)
$3N1470: RN3.5 U11.36(P0.3)
$3N1471: RN3.6 U11.35(P0.4)
$3N1472: RN3.7 U11.34(P0.5)
$3N1473: RN3.3 U11.38(P0.1)
$3N1474: RN3.4 U11.37(P0.2)
$3N1475: RN3.2 U11.39(P0.0)
$3N1476: RN3.8 U11.33(P0.6)
$3N1477: RN3.9 U11.32(P0.7)
$3N1480: Q3.1(B) R3.2
$3N1488: C16.2 U15.3(X2) X6.1(OSC1)
$3N1496: C15.2 U15.2(X1) X6.2(OSC2)
$3N1522: LED16.1(A) U11.25(P2.4)
$3N1526: LED15.1(A) U11.26(P2.5)
$3N1530: LED14.1(A) U11.27(P2.6)
$3N1534: LED17.1(A) U11.24(P2.3)
$3N1538: LED18.1(A) U11.23(P2.2)
$3N1542: LED13.1(A) U11.28(P2.7)
$3N1551: BUZZER3.2 Q3.3(C)

Not connected (* = marked no-connect by the designer): SW9 1*; U1 1(T2/P1.0)* 2(T2EX/P1.1)* 15(T1/P3.5)* 16(WR#/P3.6)* 17(RD#/P3.7)* 29(PSEN#)* 30(ALE)*; U5 8(VCC1)*; U6 1(T2/P1.0)* 2(T2EX/P1.1)* 7(P1.6)* 13(INT1#/P3.3)* 14(T0/P3.4)* 15(T1/P3.5)* 16(WR#/P3.6)* 17(RD#/P3.7)* 29(PSEN#)* 30(ALE)*; U10 8(VCC1)*; U11 1(T2/P1.0)* 2(T2EX/P1.1)* 7(P1.6)* 13(INT1#/P3.3)* 14(T0/P3.4)* 15(T1/P3.5)* 16(WR#/P3.6)* 17(RD#/P3.7)* 29(PSEN#)* 30(ALE)*; U15 8(VCC1)*; USB1 7(EH)*

## Notes on the sheets
sheet 1
- 主_烧录口
sheet 2
- 从1_烧录口

# Board PCB1
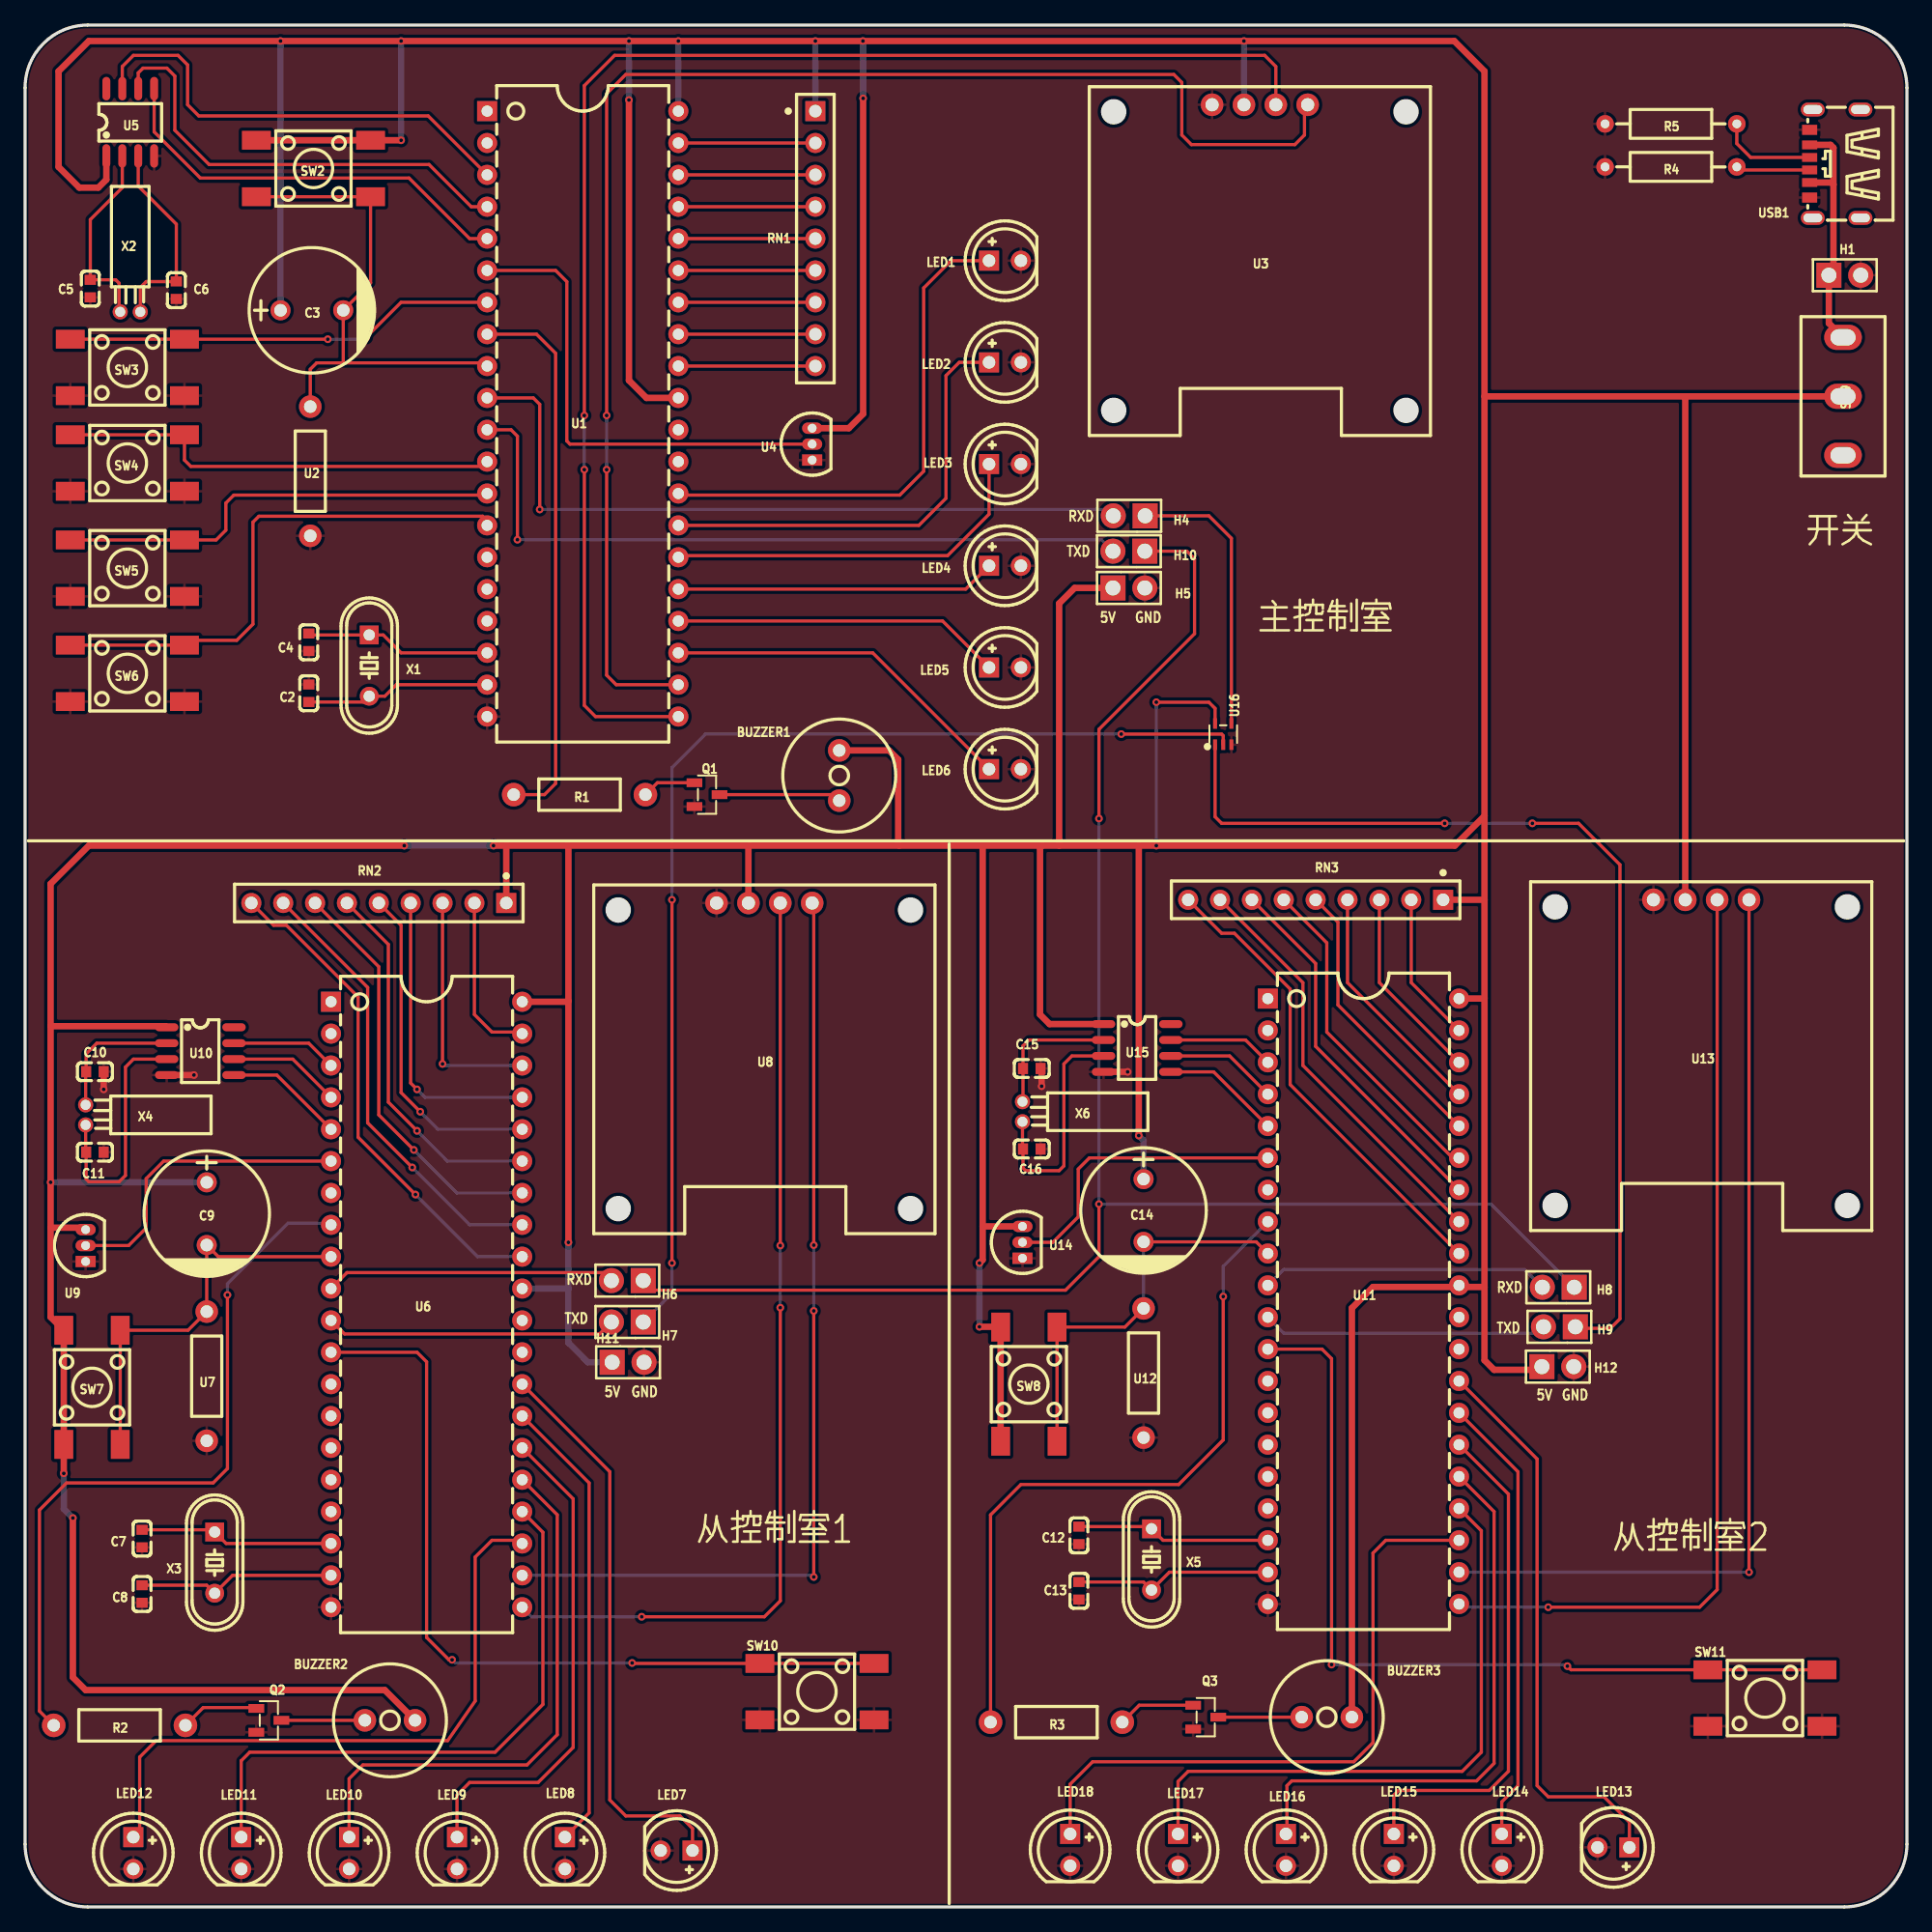
[diagram p3: board, top side]
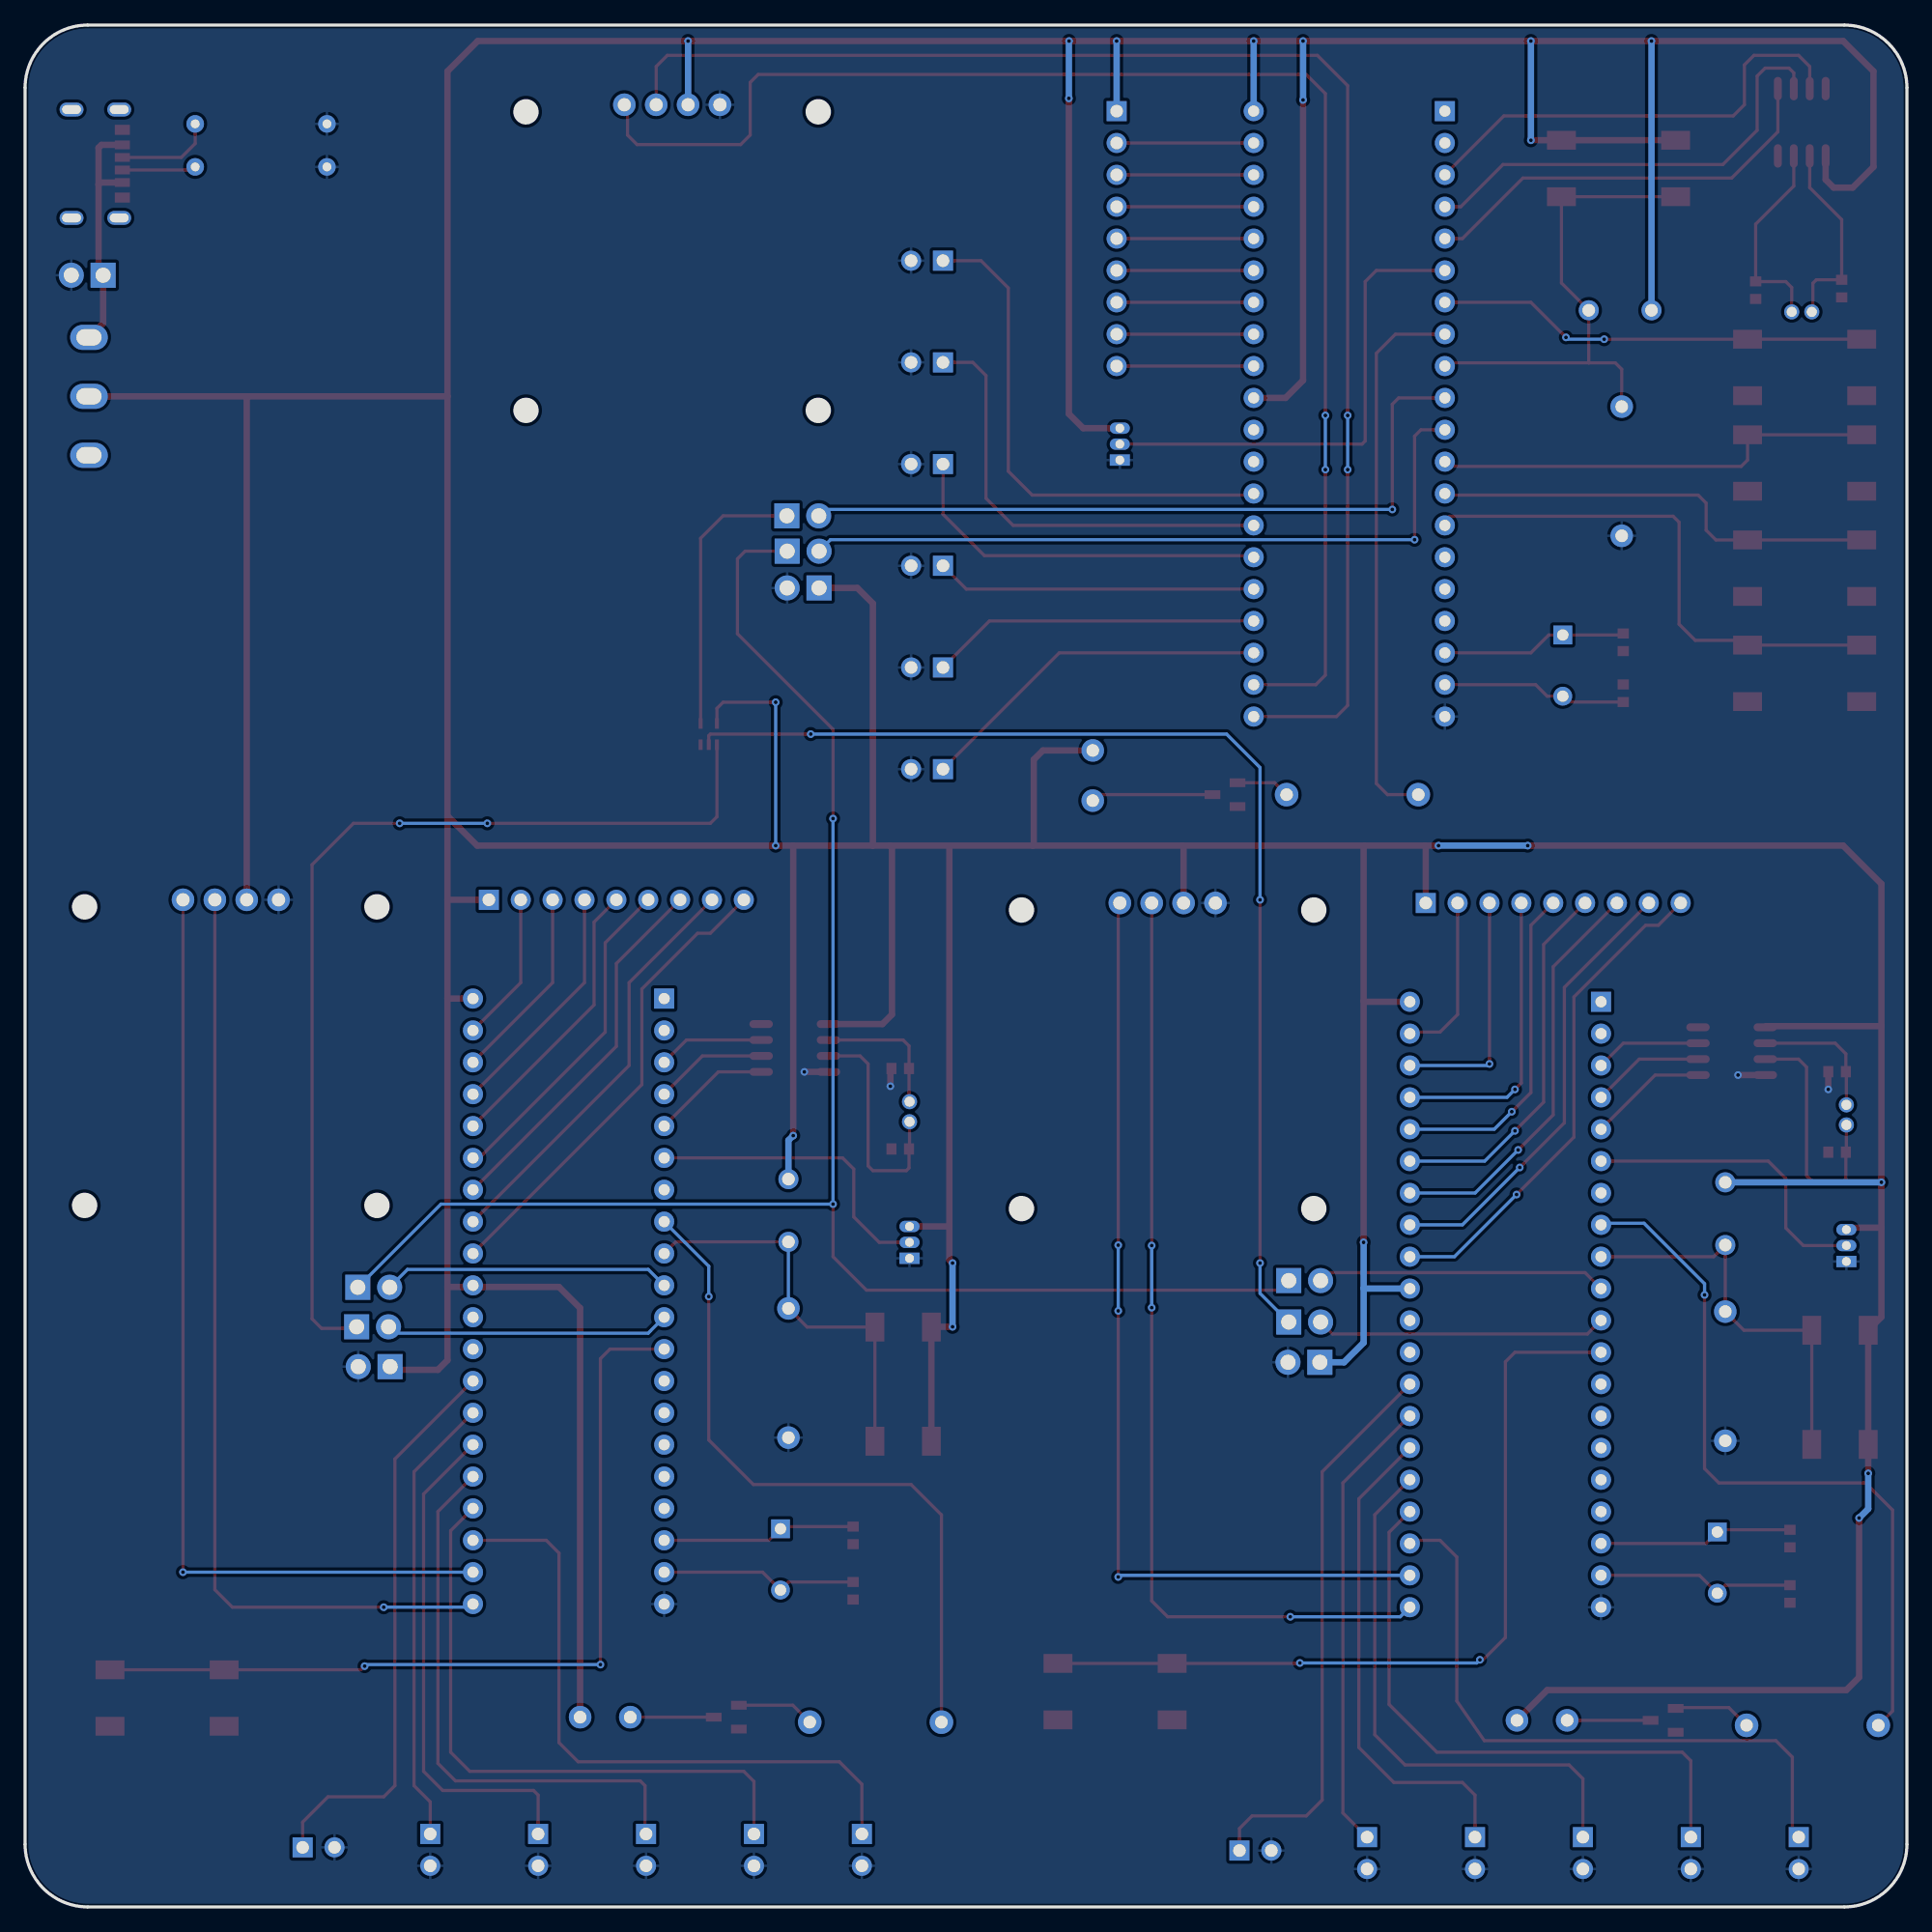
[diagram p4: board, bottom side, seen from below]

Outline 150 x 150 mm; copper layers: Top Layer, Bottom Layer. Coordinates in mm from the lower left corner of the outline.
Outline path: 0,145 0,5 arc(1.46,1.46) 5,0 145,0 arc(148.54,1.46) 150,5 150,145 arc(148.54,148.54) 145,150 5,150 arc(1.46,148.54) 0,145
Stack: Top Layer 0.035mm / Dielectric1 1.51mm FR4 er 4.5 / Bottom Layer 0.035mm

## Design rules (mm)
template: JLCPCB Capability(Two Layers Board)
spacing copperThickness1oz (default): track to track 0.102, other pairs 0.152 to 0.3
spacing copperThickness2oz: track to track 0.203, other pairs 0.152 to 0.3
track width copperThickness1oz (default): min 0.127, default 0.254, max 2.54
track width copperThickness2oz: min 0.203, default 0.254, max 2.54
differential pair differentialPair (default): width min 0.127, default 0.254, max 2.54; gap min 0.152, default 0.152
via viaSize (default): diameter min 0.5, default 0.61, max 10; hole min 0.3, default 0.305, max 6.3

## Placement (name value [footprint] x y rotation side)
BUZZER1  2.7kHz  [BUZ-TH_BD9.0-P4.00-D0.6-FD]  64.9 90.18 270 top
BUZZER2  2.7kHz  [BUZ-TH_BD9.0-P4.00-D0.6-FD]  29.08 14.87 180 top
BUZZER3  2.7kHz  [BUZ-TH_BD9.0-P4.00-D0.6-FD]  103.76 15.13 180 top
C2  33pF  [C0603]  22.61 96.74 270 top
C3  10uF  [CAP-TH_BD10.0-P5.00-D0.6-FD_1]  22.86 127.27 0 top
C4  33pF  [C0603]  22.61 100.8 90 top
C5  20pF  [C0603]  5.2 129 90 top
C6  20pF  [C0603]  12.06 128.87 90 top
C7  33pF  [C0603]  9.32 29.36 90 top
C8  33pF  [C0603]  9.32 24.94 90 top
C9  10uF  [CAP-TH_BD10.0-P5.00-D0.6-FD_1]  14.48 55.26 270 top
C10  20pF  [C0603]  5.57 66.58 180 top
C11  20pF  [C0603]  5.57 60.16 180 top
C12  33pF  [C0603]  84 29.61 90 top
C13  33pF  [C0603]  84 25.2 90 top
C14  10uF  [CAP-TH_BD10.0-P5.00-D0.6-FD_1]  89.15 55.51 270 top
C15  20pF  [C0603]  80.24 66.83 180 top
C16  20pF  [C0603]  80.24 60.41 180 top
H1  PZ254V-11-02P  [HDR-TH_2P-P2.54-V-M]  145.05 130.06 0 top
H4  PZ254V-11-02P  [HDR-TH_2P-P2.54-V-M]  88.01 110.88 180 top
H5  PZ254V-11-02P  [HDR-TH_2P-P2.54-V-M]  87.98 108.07 180 top
H6  PZ254V-11-02P  [HDR-TH_2P-P2.54-V-M]  48.01 49.92 180 top
H7  PZ254V-11-02P  [HDR-TH_2P-P2.54-V-M]  48.01 46.62 180 top
H8  PZ254V-11-02P  [HDR-TH_2P-P2.54-V-M]  122.21 49.39 180 top
H9  PZ254V-11-02P  [HDR-TH_2P-P2.54-V-M]  122.3 46.24 180 top
H10  PZ254V-11-02P  [HDR-TH_2P-P2.54-V-M]  87.99 105.13 0 top
H11  PZ254V-11-02P  [HDR-TH_2P-P2.54-V-M]  48.07 43.41 0 top
H12  PZ254V-11-02P  [HDR-TH_2P-P2.54-V-M]  122.17 43.07 0 top
LED1  TLDR5400  [LED-TH_BD5.8-P2.54-FD_RED]  78.1 131.22 0 top
LED2  TLDR5400  [LED-TH_BD5.8-P2.54-FD_RED]  78.1 123.12 0 top
LED3  TLDR5400  [LED-TH_BD5.8-P2.54-FD_RED]  78.1 115.01 0 top
LED4  TLDR5400  [LED-TH_BD5.8-P2.54-FD_RED]  78.1 106.9 0 top
LED5  TLDR5400  [LED-TH_BD5.8-P2.54-FD_RED]  78.1 98.8 0 top
LED6  TLDR5400  [LED-TH_BD5.8-P2.54-FD_RED]  78.1 90.69 0 top
LED7  TLDR5400  [LED-TH_BD5.8-P2.54-FD_RED]  51.93 4.49 180 top
LED8  TLDR5400  [LED-TH_BD5.8-P2.54-FD_RED]  43.03 4.29 270 top
LED9  TLDR5400  [LED-TH_BD5.8-P2.54-FD_RED]  34.43 4.29 270 top
LED10  TLDR5400  [LED-TH_BD5.8-P2.54-FD_RED]  25.83 4.29 270 top
LED11  TLDR5400  [LED-TH_BD5.8-P2.54-FD_RED]  17.23 4.29 270 top
LED12  TLDR5400  [LED-TH_BD5.8-P2.54-FD_RED]  8.62 4.29 270 top
LED13  TLDR5400  [LED-TH_BD5.8-P2.54-FD_RED]  126.61 4.75 180 top
LED14  TLDR5400  [LED-TH_BD5.8-P2.54-FD_RED]  117.71 4.55 270 top
LED15  TLDR5400  [LED-TH_BD5.8-P2.54-FD_RED]  109.1 4.55 270 top
LED16  TLDR5400  [LED-TH_BD5.8-P2.54-FD_RED]  100.5 4.55 270 top
LED17  TLDR5400  [LED-TH_BD5.8-P2.54-FD_RED]  91.9 4.55 270 top
LED18  TLDR5400  [LED-TH_BD5.8-P2.54-FD_RED]  83.3 4.55 270 top
Q1  SS8050(RANGE:200-350)  [SOT-23-3_L2.9-W1.3-P1.90-LS2.4-BR]  54.36 88.66 180 top
Q2  SS8050(RANGE:200-350)  [SOT-23-3_L2.9-W1.3-P1.90-LS2.4-BR]  19.43 14.87 180 top
Q3  SS8050(RANGE:200-350)  [SOT-23-3_L2.9-W1.3-P1.90-LS2.4-BR]  94.11 15.13 180 top
R1  1kΩ  [RES-TH_BD2.5-L6.5-P10.50-D0.6]  44.2 88.66 0 top
R2  1kΩ  [RES-TH_BD2.5-L6.5-P10.50-D0.6]  7.53 14.47 0 top
R3  1kΩ  [RES-TH_BD2.5-L6.5-P10.50-D0.6]  82.21 14.73 0 top
R4  5.1kΩ  [RES-TH_BD2.3-L6.5-P10.50-D0.5]  131.19 138.7 180 top
R5  5.1kΩ  [RES-TH_BD2.3-L6.5-P10.50-D0.5]  131.19 142.13 180 top
RN1  10kΩ  [RES-ARRAY-TH_9P-P2.54-D1.0]  62.99 132.98 270 top
RN2  10kΩ  [RES-ARRAY-TH_9P-P2.54-D1.0]  28.19 80.02 180 top
RN3  10kΩ  [RES-ARRAY-TH_9P-P2.54-D1.0]  102.87 80.28 180 top
SW2  KH-6X6X5H-STM  [SW-SMD_4P-L6.0-W6.0-P4.50-LS9.0_H5.0]  22.99 138.57 0 top
SW3  KH-6X6X5H-STM  [SW-SMD_4P-L6.0-W6.0-P4.50-LS9.0_H5.0]  8.15 122.71 0 top
SW4  KH-6X6X5H-STM  [SW-SMD_4P-L6.0-W6.0-P4.50-LS9.0_H5.0]  8.15 115.09 0 top
SW5  KH-6X6X5H-STM  [SW-SMD_4P-L6.0-W6.0-P4.50-LS9.0_H5.0]  8.15 106.71 0 top
SW6  KH-6X6X5H-STM  [SW-SMD_4P-L6.0-W6.0-P4.50-LS9.0_H5.0]  8.15 98.33 0 top
SW7  KH-6X6X5H-STM  [SW-SMD_4P-L6.0-W6.0-P4.50-LS9.0_H5.0]  5.33 41.41 90 top
SW8  KH-6X6X5H-STM  [SW-SMD_4P-L6.0-W6.0-P4.50-LS9.0_H5.0]  80.01 41.67 90 top
SW9  SS-12D10L5  [SW-TH_SS-12D10L5]  144.91 120.41 90 top
SW10  KH-6X6X5H-STM  [SW-SMD_4P-L6.0-W6.0-P4.50-LS9.0_H5.0]  63.12 17.16 0 top
SW11  KH-6X6X5H-STM  [SW-SMD_4P-L6.0-W6.0-P4.50-LS9.0_H5.0]  138.68 16.65 0 top
U1  STC89C52RC-40I-PDIP40  [DIP-40_L52.0-W13.7-P2.54-LS15.2-BL]  44.45 119.01 270 top
U2  10kΩ  [RES-TH_BD2.3-L6.3-P10.30-D0.6]  22.73 114.44 90 top
U3  HS96L03W2C03  [OLED-TH_L27.8-W27.2-P2.54_C9900033791]  98.43 143.65 0 top
U4  DS18B20(UMW)  [TO-92-3_L4.9-W3.7-P1.27-L]  62.74 116.6 90 top
U5  DS1302-TD  [SOP-8_L4.9-W3.9-P1.27-LS6.0-BL]  8.38 142.25 0 top
U6  STC89C52RC-40I-PDIP40  [DIP-40_L52.0-W13.7-P2.54-LS15.2-BL]  32 48.02 270 top
U7  10kΩ  [RES-TH_BD2.3-L6.3-P10.30-D0.6]  14.48 42.3 90 top
U8  HS96L03W2C03  [OLED-TH_L27.8-W27.2-P2.54_C9900033791]  58.93 80.02 0 top
U9  DS18B20(UMW)  [TO-92-3_L4.9-W3.7-P1.27-L]  4.83 52.72 90 top
U10  DS1302-TD  [SOP-8_L4.9-W3.9-P1.27-LS6.0-BL]  13.97 68.21 270 top
U11  STC89C52RC-40I-PDIP40  [DIP-40_L52.0-W13.7-P2.54-LS15.2-BL]  106.68 48.27 270 top
U12  10kΩ  [RES-TH_BD2.3-L6.3-P10.30-D0.6]  89.15 42.56 90 top
U13  HS96L03W2C03  [OLED-TH_L27.8-W27.2-P2.54_C9900033791]  133.6 80.28 0 top
U14  DS18B20(UMW)  [TO-92-3_L4.9-W3.7-P1.27-L]  79.5 52.97 90 top
U15  DS1302-TD  [SOP-8_L4.9-W3.9-P1.27-LS6.0-BL]  88.65 68.47 270 top
U16  74LVC1G08GW,125  [SOT-353_L2.1-W1.3-P0.65-LS2.3-BR]  95.5 93.48 270 top
USB1  TYPE-C 6P  [TYPE-C-SMD_TYPE-C-6P]  144.27 138.95 90 top
X1  11.0592MHz  [HC-49US_L11.5-W4.5-P4.88]  27.43 98.95 270 top
X2  32.768kHz  [OSC-TH_BD3.1-P0.8-D0.3]  8.38 127.14 270 top
X3  11.0592MHz  [HC-49US_L11.5-W4.5-P4.88]  15.11 27.44 270 top
X4  32.768kHz  [OSC-TH_BD3.1-P0.8-D0.3]  4.83 63.13 180 top
X5  11.0592MHz  [HC-49US_L11.5-W4.5-P4.88]  89.79 27.7 270 top
X6  32.768kHz  [OSC-TH_BD3.1-P0.8-D0.3]  79.5 63.39 180 top

## Footprints (pads in the part's own frame, mm; a bottom-side part is the same pattern mirrored in y, then rotated)
BUZ-TH_BD9.0-P4.00-D0.6-FD
  round 1.8 hole 1: 1(-2,0) 2(2,0)
C0603
  rect 0.8x0.9 smd: 1(-0.7,0) 2(0.7,0)
CAP-TH_BD10.0-P5.00-D0.6-FD_1
  round 1.6 hole 1: 1(-2.5,0) 2(2.5,0)
DIP-40_L52.0-W13.7-P2.54-LS15.2-BL
  rect 1.6x1.6 hole 0.889: 1(-24.13,-7.62)
  round 1.6 hole 0.889: 2(-21.59,-7.62) 3(-19.05,-7.62) 4(-16.51,-7.62) 5(-13.97,-7.62) 6(-11.43,-7.62) 7(-8.89,-7.62) 8(-6.35,-7.62) 9(-3.81,-7.62) 10(-1.27,-7.62) 11(1.27,-7.62) 12(3.81,-7.62) 13(6.35,-7.62) 14(8.89,-7.62) 15(11.43,-7.62) 16(13.97,-7.62) 17(16.51,-7.62) 18(19.05,-7.62) 19(21.59,-7.62) 20(24.13,-7.62) 21(24.13,7.62) 22(21.59,7.62) 23(19.05,7.62) 24(16.51,7.62) 25(13.97,7.62) 26(11.43,7.62) 27(8.89,7.62) 28(6.35,7.62) 29(3.81,7.62) 30(1.27,7.62) 31(-1.27,7.62) 32(-3.81,7.62) 33(-6.35,7.62) 34(-8.89,7.62) 35(-11.43,7.62) 36(-13.97,7.62) 37(-16.51,7.62) 38(-19.05,7.62) 39(-21.59,7.62) 40(-24.13,7.62)
HC-49US_L11.5-W4.5-P4.88
  rect 1.5x1.5 hole 0.9: 1(-2.44,0)
  round 1.5 hole 0.9: 2(2.44,0)
HDR-TH_2P-P2.54-V-M
  rect 2x2 hole 1.2: 1(-1.27,0)
  round 2 hole 1.2: 2(1.27,0)
LED-TH_BD5.8-P2.54-FD_RED
  rect 1.6x1.6 hole 1: 1(-1.27,0)
  round 1.6 hole 1: 2(1.27,0)
OLED-TH_L27.8-W27.2-P2.54_C9900033791
  round 1.8 hole 1.05: 1(-3.81,0) 2(-1.27,0) 3(1.27,0) 4(3.81,0)
OSC-TH_BD3.1-P0.8-D0.3
  round 1.2 hole 0.8: 1(0,0.8) 2(0,-0.8)
RES-ARRAY-TH_9P-P2.54-D1.0
  rect 1.6x1.6 hole 1: 1(-10.16,0)
  round 1.6 hole 1: 2(-7.62,0) 3(-5.08,0) 4(-2.54,0) 5(0,0) 6(2.54,0) 7(5.08,0) 8(7.62,0) 9(10.16,0)
RES-TH_BD2.3-L6.3-P10.30-D0.6
  round 1.8 hole 1: 1(-5.15,0) 2(5.15,0)
RES-TH_BD2.3-L6.5-P10.50-D0.5
  round 1.4 hole 0.7: 1(-5.25,0) 2(5.25,0)
RES-TH_BD2.5-L6.5-P10.50-D0.6
  round 1.879 hole 1: 1(-5.25,0) 2(5.25,0)
SOP-8_L4.9-W3.9-P1.27-LS6.0-BL
  oval 0.63x1.865 smd: 1(-1.905,-2.683) 2(-0.635,-2.683) 3(0.635,-2.683) 4(1.905,-2.683) 5(1.905,2.683) 6(0.635,2.683) 7(-0.635,2.683) 8(-1.905,2.683)
SOT-23-3_L2.9-W1.3-P1.90-LS2.4-BR
  rect 1.25x0.7 smd: 1(1,-0.95) 2(1,0.95) 3(-1,0)
SOT-353_L2.1-W1.3-P0.65-LS2.3-BR
  rect 0.839x0.315 smd: 1(0.845,-0.65) 2(0.845,0) 3(0.845,0.65) 4(-0.845,0.65) 5(-0.845,-0.65)
SW-SMD_4P-L6.0-W6.0-P4.50-LS9.0_H5.0
  rect 2.3x1.5 smd: 1(-4.55,2.25) 2(4.55,2.25) 3(-4.55,-2.25) 4(4.55,-2.25)
SW-TH_SS-12D10L5
  oval 2x3 hole 1.3x2: 1(-4.7,0) 2(0,0) 3(4.7,0)
TO-92-3_L4.9-W3.7-P1.27-L
  rect 0.9x1.6 hole 0.7: 1(-1.27,0)
  oval 0.9x1.6 hole 0.7: 2(0,0) 3(1.27,0)
TYPE-C-SMD_TYPE-C-6P
  oval 1.1x1.9 hole 0.7x1.5: 7(-4.32,1.775) 7(-4.32,-2.025) 7(4.32,1.775) 7(4.32,-2.025)
  rect 0.7x1.2 smd: A5(-0.5,2.025) A9(1.5,2.025) B5(0.5,2.025) B9(-1.5,2.025)
  rect 0.8x1.2 smd: A12(2.7,2.025) B12(-2.7,2.025)

## Nets
As in the schematic.

Pads without a net: SW9 1; U1 1 2 15 16 17 29 30; U5 8; U6 1 2 7 13 14 15 16 17 29 30; U10 8; U11 1 2 7 13 14 15 16 17 29 30; U15 8; USB1 7

## Via types
v1: diameter 0.61, hole 0.305, Top Layer to Bottom Layer, 61 vias

## Routing (per net, layer and track width the routed paths; a pad name or vN(x,y) marks a point on that pad's centre or on a via; arc(x,y) is an arc through that point)
+5V: length 924.1
  Top Layer w0.254: v1(90.17,96.03) 94.36,96.03 94.85,95.53 U16.5
  Top Layer w0.508: U4.3 65.66,117.87 66.8,119.01 v1(66.8,144.16) ; BUZZER3.1 105.76,47.73 107.44,49.42 116.33,49.42 ; v1(76.07,46.24) 77.74,46.24 77.76,46.22 77.76,37.12 ; 38.4,84.59 v1(37.34,84.59) ; 38.4,84.59 38.35,84.55 RN2.1 ; 38.4,84.59 43.24,84.59 ; 132.17,120.41 132.33,120.25 U13.2 ; 132.17,120.41 116.33,120.41 ; 132.17,120.41 SW9.2 ; 2.03,54.14 4.67,54.14 U9.3 ; 2.03,54.14 2.03,47.02 SW7.2 v1(3.08,34.56) ; 2.03,54.14 v1(2.03,57.76) 2.03,70.2 ; 116.33,72.44 116.33,80.28 ; 116.33,72.44 116.29,72.4 U11.40 ; 116.33,72.44 116.33,49.42 ; 116.33,80.28 RN3.1 ; 116.33,80.28 116.33,86.97 ; v1(88.77,61.48) 88.77,84.57 88.8,84.59 ; 43.24,84.59 43.31,84.53 43.31,72.21 ; 43.24,84.59 57.74,84.59 ; 57.74,84.59 57.66,84.51 U8.2 ; 57.74,84.59 69.68,84.59 ; 2.03,70.2 2.03,81.55 5.08,84.59 v1(30.23,84.59) ; 2.03,70.2 11.2,70.2 U10.1 ; 43.31,72.21 43.25,72.15 U6.40 ; 43.31,72.21 v1(43.31,52.97) ; 88.8,84.59 v1(90.17,84.59) 113.96,84.59 116.33,86.97 ; 88.8,84.59 82.43,84.59 ; 116.33,120.41 116.33,86.97 ; 116.33,120.41 116.33,146.32 113.92,148.73 v1(97.16,148.73) v1(66.78,148.73) v1(62.99,148.73) v1(52.07,148.73) v1(48.13,148.73) v1(29.97,148.73) v1(20.36,148.73) 5.08,148.73 2.67,146.32 2.67,138.7 4.32,137.05 5.84,137.05 6.48,137.68 U5.1 ; U15.1 81.66,70.37 80.9,71.13 80.9,84.41 81.08,84.59 ; H12.1 120.65,42.81 117.09,42.81 116.33,43.57 116.33,49.42 ; 81.08,84.59 69.68,84.59 ; 81.08,84.59 82.43,84.59 ; BUZZER1.1 68.87,92.18 69.6,91.45 69.6,84.67 69.68,84.59 ; U1.31 49.53,120.28 48.13,121.68 v1(48.13,144.03) ; 82.43,84.59 82.42,84.6 82.42,103.9 83.66,105.13 H10.1 ; 76.33,54.24 76.33,51.57 v1(76.07,51.32) ; 76.33,54.24 U14.3 ; 76.33,54.24 76.33,84.34 ; SW2.1 27.54,140.82 ; BUZZER2.1 28.67,17.28 4.83,17.28 3.81,18.3 v1(3.81,31) ; SW2.2 v1(29.97,140.82)
  Bottom Layer w0.254: v1(90.17,96.03) v1(90.17,84.59)
  Bottom Layer w0.508: v1(37.34,84.59) v1(30.23,84.59) ; U1.40 v1(52.07,148.73) ; v1(88.77,61.48) 89.15,61.1 C14.1 ; v1(3.81,31) 3.08,31.73 v1(3.08,34.56) ; v1(43.31,52.97) 43.31,49.29 ; 43.31,49.29 43.31,44.97 44.87,43.41 H11.1 ; 43.31,49.29 U6.31 ; v1(48.13,144.03) v1(48.13,148.73) ; C3.1 v1(20.36,148.73) ; RN1.1 v1(62.99,148.73) ; C9.1 v1(2.03,57.76) ; U3.2 v1(97.16,148.73) ; v1(29.97,140.82) v1(29.97,148.73) ; v1(76.07,46.24) v1(76.07,51.32) ; v1(66.8,144.16) 66.8,148.6
GND: length 7
  Top Layer w0.508: C15.1 81.03,66.75 v1(81.03,65.42) ; U10.4 v1(13.46,66.31) ; 85.96,66.56 v1(87.88,66.56) ; C10.1 v1(6.27,65.16)
V0: length 19.7
  Top Layer w0.508: 144.15,137.3 144.15,140.22 143.91,140.45 USB1.A9 ; 144.15,137.3 144.15,130.43 H1.1 143.78,126.24 SW9.3 ; 144.15,137.3 143.99,137.45 USB1.B9
1: length 58.7
  Top Layer w0.254: U1.11 38.73,117.74 39.24,117.23 v1(39.24,108.98)
  Bottom Layer w0.254: v1(39.24,108.98) 85.8,108.98 H5.2
1TXD: length 141.4
  Top Layer w0.254: v1(85.6,56.02) 85.6,51.83 82.93,49.16 50.04,49.16 H6.1 ; v1(85.6,86.75) 85.6,93.87 93.22,101.49 93.22,107.45 92.61,108.07 H5.1
  Bottom Layer w0.254: v1(85.6,86.75) v1(85.6,56.02) 116.85,56.02 H8.1
2: length 23.1
  Top Layer w0.254: U6.10 25.65,50.56 46.1,50.56 H6.2
3: length 23.2
  Top Layer w0.254: U6.11 25.46,45.67 45.78,45.67 H7.2
4: length 23
  Bottom Layer w0.254: H8.2 119.52,50.81 100.33,50.81 U11.10
5: length 22.7
  Bottom Layer w0.254: U11.11 100.33,45.73 120.52,45.73 H9.2
A: length 91
  Top Layer w0.254: U16.2 95.5,93.36 95.38,93.48 v1(87.38,93.48) ; v1(51.56,80.28) v1(51.56,51.32)
  Bottom Layer w0.254: v1(51.56,51.32) 51.56,48.91 H7.1 ; v1(87.38,93.48) 54.23,93.48 51.56,90.82 v1(51.56,80.28)
B: length 79.7
  Top Layer w0.254: v1(113.16,86.37) 95.38,86.37 94.85,86.9 U16.1 ; H9.1 123.7,46.11 126.37,46.11 127.13,46.88 127.13,83.07 123.82,86.37 v1(120.14,86.37)
  Bottom Layer w0.254: v1(113.16,86.37) v1(120.14,86.37)
BUZZER1: length 44.1
  Top Layer w0.254: U1.8 40.77,125.36 42.29,123.84 42.29,89.55 41.4,88.66 R1.1
BUZZER2: length 59
  Top Layer w0.254: v1(16.13,48.78) 16.13,34.94 14.99,33.79 3.3,33.79 1.14,31.64 1.14,15.61 R2.1
  Bottom Layer w0.254: U6.8 24.26,54.5 20.95,54.5 16.13,49.67 v1(16.13,48.78)
BUZZER3: length 56.4
  Top Layer w0.254: R3.1 76.96,31.25 79.38,33.67 91.95,33.67 95.5,37.22 v1(95.5,48.65)
  Bottom Layer w0.254: U11.8 95.5,51.07 v1(95.5,48.65)
C1_SW1: length 66.4
  Top Layer w0.254: U6.12 31.24,44.21 32,43.45 32,21.48 33.78,19.7 v1(34.04,19.7) ; v1(48.39,19.44) 48.42,19.41 SW10.1 67.67,19.41
  Bottom Layer w0.254: v1(34.04,19.7) 34.29,19.44 v1(48.39,19.44)
C2_SW1: length 69
  Top Layer w0.254: SW11.2 SW11.1 123.23,18.9 v1(122.94,19.19) ; U11.12 103.38,44.46 104.14,43.7 v1(104.14,19.32)
  Bottom Layer w0.254: v1(122.94,19.19) 122.81,19.32 v1(104.14,19.32)
CE1.1: length 33.5
  Top Layer w0.254: 10.29,144.94 10.29,141.49 13.97,137.81 30.61,137.81 35.43,132.98 U1.5
CE1.2: length 9.5
  Top Layer w0.254: U10.5 20.07,66.31 U6.5
CE1.3: length 9.5
  Top Layer w0.254: 91.33,66.56 94.74,66.56 U11.5
DQ1: length 39.1
  Top Layer w0.254: U1.6 42.29,130.44 43.18,129.55 43.18,116.85 43.43,116.6 U4.2
DQ2: length 24.7
  Top Layer w0.254: U6.6 11.05,59.45 9.65,58.05 9.65,54.11 8.25,52.72 U9.2
DQ3: length 24.6
  Top Layer w0.254: U11.6 84.84,59.7 83.95,58.81 83.95,55 81.91,52.97 U14.2
IO1.1: length 36.3
  Top Layer w0.254: U1.4 35.56,135.52 32.19,138.89 14.67,138.89 11.94,141.62 11.94,145.94 11.3,146.57 9.4,146.57 9.02,146.19 U5.6
IO1.2: length 9
  Top Layer w0.254: U6.4 21.34,67.58 U10.6
IO1.3: length 9
  Top Layer w0.254: U11.4 96.01,67.83 U15.6
SCL1: length 116.8
  Top Layer w0.254: 99.69,143.65 99.69,146.7 98.81,147.59 46.99,147.59 44.58,145.17 v1(44.58,118.88) ; U1.21 45.47,94.88 44.58,95.77 v1(44.58,114.57)
  Bottom Layer w0.254: v1(44.58,114.57) v1(44.58,118.88)
SCL2: length 77
  Top Layer w0.254: U8.3 v1(60.2,52.72) ; v1(49.15,23.13) 58.93,23.13 60.2,24.4 v1(60.2,47.76)
  Bottom Layer w0.254: U6.21 40.39,23.13 v1(49.15,23.13) ; v1(60.2,52.72) v1(60.2,47.76)
SCL3: length 76.2
  Top Layer w0.254: U13.3 134.87,25.29 133.48,23.89 v1(121.41,23.89)
  Bottom Layer w0.254: U11.21 114.55,23.89 v1(121.41,23.89)
SCLK1.1: length 37
  Top Layer w0.254: U1.3 32.13,142.76 13.84,142.76 12.95,143.65 12.95,146.82 12.19,147.59 8.64,147.59 7.75,146.7 U5.7
SCLK1.2: length 8.5
  Top Layer w0.254: 16.65,68.85 22.61,68.85 U6.3
SCLK1.3: length 8.5
  Top Layer w0.254: U11.3 97.28,69.1 U15.7
SDA1: length 116.2
  Top Layer w0.254: v1(46.36,118.88) 46.36,144.54 47.88,146.06 91.57,146.06 92.2,145.43 92.2,141.24 92.96,140.47 101.22,140.47 101.98,141.24 101.98,143.4 102.23,143.65 ; U1.22 47.12,97.42 46.36,98.18 v1(46.36,114.57)
  Bottom Layer w0.254: v1(46.36,114.57) v1(46.36,118.88)
SDA2: length 77.1
  Top Layer w0.254: v1(62.87,52.75) 62.87,79.9 U8.4 ; v1(62.87,26.3) v1(62.87,47.51)
  Bottom Layer w0.254: v1(62.87,47.51) v1(62.87,52.75) ; U6.22 62.74,26.43 v1(62.87,26.3)
SDA3: length 76.7
  Top Layer w0.254: v1(137.41,26.68) U13.4
  Bottom Layer w0.254: U11.22 v1(137.41,26.68)
SW1: length 34.4
  Top Layer w0.254: SW3.1 SW3.2 v1(24.13,124.96) ; v1(27.18,125.11) 29.97,127.9 U1.7
  Bottom Layer w0.254: v1(27.18,125.11) 27.03,124.96 v1(24.13,124.96)
SW2: length 35.6
  Top Layer w0.254: U1.12 36.45,114.82 13.21,114.82 12.7,115.33 SW4.2 SW4.1
SW3: length 36
  Top Layer w0.254: SW5.1 SW5.2 15.22,108.96 16,109.74 16,111.9 16.64,112.53 36.7,112.53 U1.13
SW4: length 42.8
  Top Layer w0.254: U1.14 36.83,110.5 36.48,110.85 18.64,110.85 18.16,110.38 18.16,102.25 16.87,100.96 12.96,100.96 12.7,100.7 SW6.2 SW6.1
Y: length 22.4
  Top Layer w0.254: U16.4 96.15,109.09 94.36,110.88 H4.1
$1N2205: length 10.9
  Top Layer w0.254: U1.35 RN1.6
$1N2206: length 10.9
  Top Layer w0.254: U1.34 RN1.7
$1N2207: length 10.9
  Top Layer w0.254: U1.33 RN1.8
$1N2208: length 10.9
  Top Layer w0.254: U1.32 RN1.9
$1N2210: length 10.9
  Top Layer w0.254: U1.39 RN1.2
$1N2211: length 10.9
  Top Layer w0.254: U1.38 RN1.3
$1N2212: length 10.9
  Top Layer w0.254: U1.37 RN1.4
$1N2213: length 10.9
  Top Layer w0.254: U1.36 RN1.5
$1N2215: length 14.9
  Top Layer w0.254: U1.18 29.97,99.96 28.55,101.39 X1.1 22.73,101.39 C4.2
$1N2216: length 14.8
  Top Layer w0.254: U1.19 29.59,97.42 28.67,96.51 X1.2 26.97,96.04 C2.2
$1N2230: length 40.6
  Top Layer w0.254: SW2.3 SW2.4 27.54,129.44 C3.2 25.36,123.09 25.35,123.08 ; 25.35,123.08 23.24,123.08 22.73,122.57 U2.2 ; 25.35,123.08 36.58,123.08 U1.9
$1N2902: length 41.1
  Top Layer w0.254: U1.28 52.2,112.53 69.72,112.53 71.63,114.44 71.63,129.05 73.8,131.22 LED1.1
$1N2907: length 35.9
  Top Layer w0.254: U1.27 71.25,110.12 73.41,112.28 73.41,122.06 74.46,123.12 LED2.1
$1N2917: length 30.2
  Top Layer w0.254: LED3.1 76.84,111.01 73.53,107.71 52.2,107.71 U1.26
$1N2940: length 25.5
  Top Layer w0.254: U1.25 74.97,105.04 LED4.1
$1N2958: length 26.3
  Top Layer w0.254: U1.24 73.13,102.5 LED5.1
$1N2967: length 28.6
  Top Layer w0.254: U1.23 67.56,99.96 LED6.1
$1N3387: length 4.3
  Top Layer w0.254: Q1.1 50.4,89.61 R1.2
$1N3460: length 9.7
  Top Layer w0.254: Q1.3 64.42,88.66 BUZZER1.2
$1N4123: length 15.7
  Top Layer w0.254: X2.2 7.49,127.23 7.49,129.43 7.22,129.7 C5.2 5.2,134.5 7.75,137.05 U5.2
$1N4127: length 16.3
  Top Layer w0.254: X2.1 9.18,129.08 9.65,129.55 12.04,129.55 C6.2 12.06,134.13 9.02,137.17 U5.3
$1N6009: length 7.8
  Top Layer w0.254: USB1.B5 137.55,139.45 136.44,140.56 R5.1
$1N6015: length 5.9
  Top Layer w0.254: R4.1 136.69,138.45 USB1.A5
$1N7833: length 58.7
  Top Layer w0.254: U1.10 40.51,120.28 41.02,119.77 v1(41.02,111.39)
  Bottom Layer w0.254: H4.2 86.23,111.39 v1(41.02,111.39)
$2N1741: length 45.3
  Top Layer w0.254: LED7.1 53.2,6.25 52.2,7.25 47.88,7.25 46.61,8.52 46.61,34.68 U6.28
$2N1744: length 39.7
  Top Layer w0.254: LED9.1 34.43,8.91 35.43,9.92 40.89,9.92 43.69,12.71 43.69,32.53 U6.26
$2N1748: length 44.2
  Top Layer w0.254: LED10.1 25.83,10.22 26.92,11.32 40,11.32 42.42,13.73 42.42,31.25 U6.25
$2N1752: length 36.6
  Top Layer w0.254: LED8.1 44.96,7.49 44.96,33.79 U6.27
$2N1764: length 32.2
  Top Layer w0.254: U6.9 15.41,51.83 C9.2 U7.2 12.99,45.97 SW7.4 7.58,36.87
$2N1827: length 15.9
  Top Layer w0.254: U6.19 16.54,26.43 X3.2 14.47,25.64 C8.2
$2N1829: length 15.5
  Top Layer w0.254: U6.18 16.03,28.97 X3.1 14.94,30.06 C7.2
$2N1841: length 48
  Top Layer w0.254: LED11.1 17.23,11.65 17.91,12.33 37.47,12.33 41.28,16.14 41.28,29.86 U6.24
$2N1845: length 51.4
  Top Layer w0.254: U6.23 39.37,29.22 37.21,29.22 35.88,27.89 35.88,16.41 33.69,13.25 10.45,13.25 9.13,11.94 9.13,6.07 LED12.1
$2N1853: length 33
  Top Layer w0.254: v1(30.99,60.34) 28.19,63.13 28.19,74.94 RN2.7
  Bottom Layer w0.254: U6.34 34.42,56.91 v1(30.99,60.34)
$2N1854: length 36
  Top Layer w0.254: RN2.8 27.3,73.29 27.3,62.5 v1(30.86,58.94)
  Bottom Layer w0.254: v1(30.86,58.94) 35.43,54.37 U6.33
$2N1855: length 39.8
  Top Layer w0.254: RN2.9 19.81,78.25 20.83,78.25 26.54,72.53 26.54,61.35 v1(31.11,56.78)
  Bottom Layer w0.254: U6.32 36.07,51.83 v1(31.11,56.78)
$2N1856: length 19.2
  Top Layer w0.254: RN2.3 v1(33.27,67.2)
  Bottom Layer w0.254: U6.38 33.4,67.07 v1(33.27,67.2)
$2N1857: length 23.7
  Top Layer w0.254: RN2.4 30.73,65.67 v1(31.24,65.16)
  Bottom Layer w0.254: U6.37 31.88,64.53 v1(31.24,65.16)
$2N1858: length 29.9
  Top Layer w0.254: v1(31.24,61.86) 28.96,64.15 28.96,76.72 RN2.6
  Bottom Layer w0.254: v1(31.24,61.86) 33.66,59.45 U6.35
$2N1859: length 26.7
  Top Layer w0.254: RN2.5 29.97,78.25 29.97,64.91 v1(31.5,63.39)
  Bottom Layer w0.254: U6.36 32.89,61.99 v1(31.5,63.39)
$2N1860: length 13.3
  Top Layer w0.254: RN2.2 35.81,71.13 37.21,69.74 39.5,69.74 U6.39
$2N1864: length 6.7
  Top Layer w0.254: Q2.3 BUZZER2.2
$2N1872: length 20
  Top Layer w0.254: U10.3 8.64,67.58 8,66.94 8,58.31 7.49,57.8 5.08,57.8 4.87,58.01 C11.2 4.83,60.2 X4.1
$2N1879: length 10.9
  Top Layer w0.254: 11.29,68.85 5.72,68.85 4.87,68 C10.2 4.83,66.54 X4.2
$2N1897: length 6.3
  Top Layer w0.254: Q2.1 18.36,15.89 14.19,15.89 R2.2
$3N1449: length 15.5
  Top Layer w0.254: C12.2 89.61,30.31 X5.1 90.71,29.22 U11.18
$3N1454: length 32.2
  Top Layer w0.254: U11.9 98.13,53.01 C14.2 ; U12.2 87.66,46.22 82.26,46.22 SW8.3
  Bottom Layer w0.254: U12.2 C14.2
$3N1464: length 15.9
  Top Layer w0.254: C13.2 89.15,25.9 X5.2 91.21,26.68 U11.19
$3N1470: length 22.8
  Top Layer w0.254: RN3.5 104.65,78.5 104.65,71.89 U11.36
$3N1471: length 26.7
  Top Layer w0.254: RN3.6 103.76,76.85 103.76,69.74 113.79,59.7 U11.35
$3N1472: length 30
  Top Layer w0.254: U11.34 102.87,68.59 102.87,75.2 RN3.7
$3N1473: length 15.6
  Top Layer w0.254: U11.38 107.95,73.67 RN3.3
$3N1474: length 19.2
  Top Layer w0.254: RN3.4 105.41,73.67 U11.37
$3N1475: length 12
  Top Layer w0.254: RN3.2 110.49,73.67 U11.39
$3N1476: length 33.5
  Top Layer w0.254: U11.33 101.85,67.07 101.85,73.67 RN3.8
$3N1477: length 37.7
  Top Layer w0.254: U11.32 100.84,65.55 100.84,73.17 96.39,77.61 95.38,77.61 RN3.9
$3N1480: length 6.2
  Top Layer w0.254: R3.2 88.81,16.08 Q3.1
$3N1488: length 18.8
  Top Layer w0.254: U15.3 83.44,67.83 82.8,67.2 82.8,59.07 82.42,58.69 79.76,58.69 79.54,58.9 C16.2 79.5,60.45 X6.1
$3N1496: length 11.1
  Top Layer w0.254: U15.2 80.01,69.1 79.54,68.63 C15.2 79.54,64.23 X6.2
$3N1522: length 45.1
  Top Layer w0.254: LED16.1 100.58,5.9 100.58,9.66 100.97,10.05 115.7,10.05 117.09,11.44 117.09,31.51 U11.25
$3N1526: length 40.7
  Top Layer w0.254: LED15.1 109.1,8.91 109.47,9.28 116.71,9.28 118.24,10.81 118.24,32.91 U11.26
$3N1530: length 36
  Top Layer w0.254: U11.27 119,34.68 119,9.66 117.71,8.37 LED14.1
$3N1534: length 49.5
  Top Layer w0.254: U11.24 116.08,29.99 116.08,12.33 114.55,10.81 92.71,10.81 91.9,10 LED17.1
$3N1538: length 51.9
  Top Layer w0.254: U11.23 108.46,29.22 107.44,28.21 107.44,13.09 105.92,11.57 85.09,11.57 83.3,9.78 LED18.1
$3N1542: length 45.4
  Top Layer w0.254: U11.28 120.52,35.7 120.52,9.66 121.41,8.78 125.86,8.78 127.88,6.76 LED13.1
$3N1551: length 6.7
  Top Layer w0.254: Q3.3 BUZZER3.2

## Copper pours and planes (outline as drawn; the poured copper is in the pictures)
GND on Top Layer: -9.27,156.6 163.32,156.6 163.32,-9.26 -9.27,-9.26
GND on Bottom Layer: -20.7,158.89 188.72,158.89 188.72,-26.02 -20.7,-26.02

## Text on the board
Top Silkscreen Layer: TXD | RXD | 5V | GND | 从控制室1 | 主控制室 | 从控制室2 | 开关
